# Altium project PolySomeCrypto01.PrjPcb (part 1 of 2)
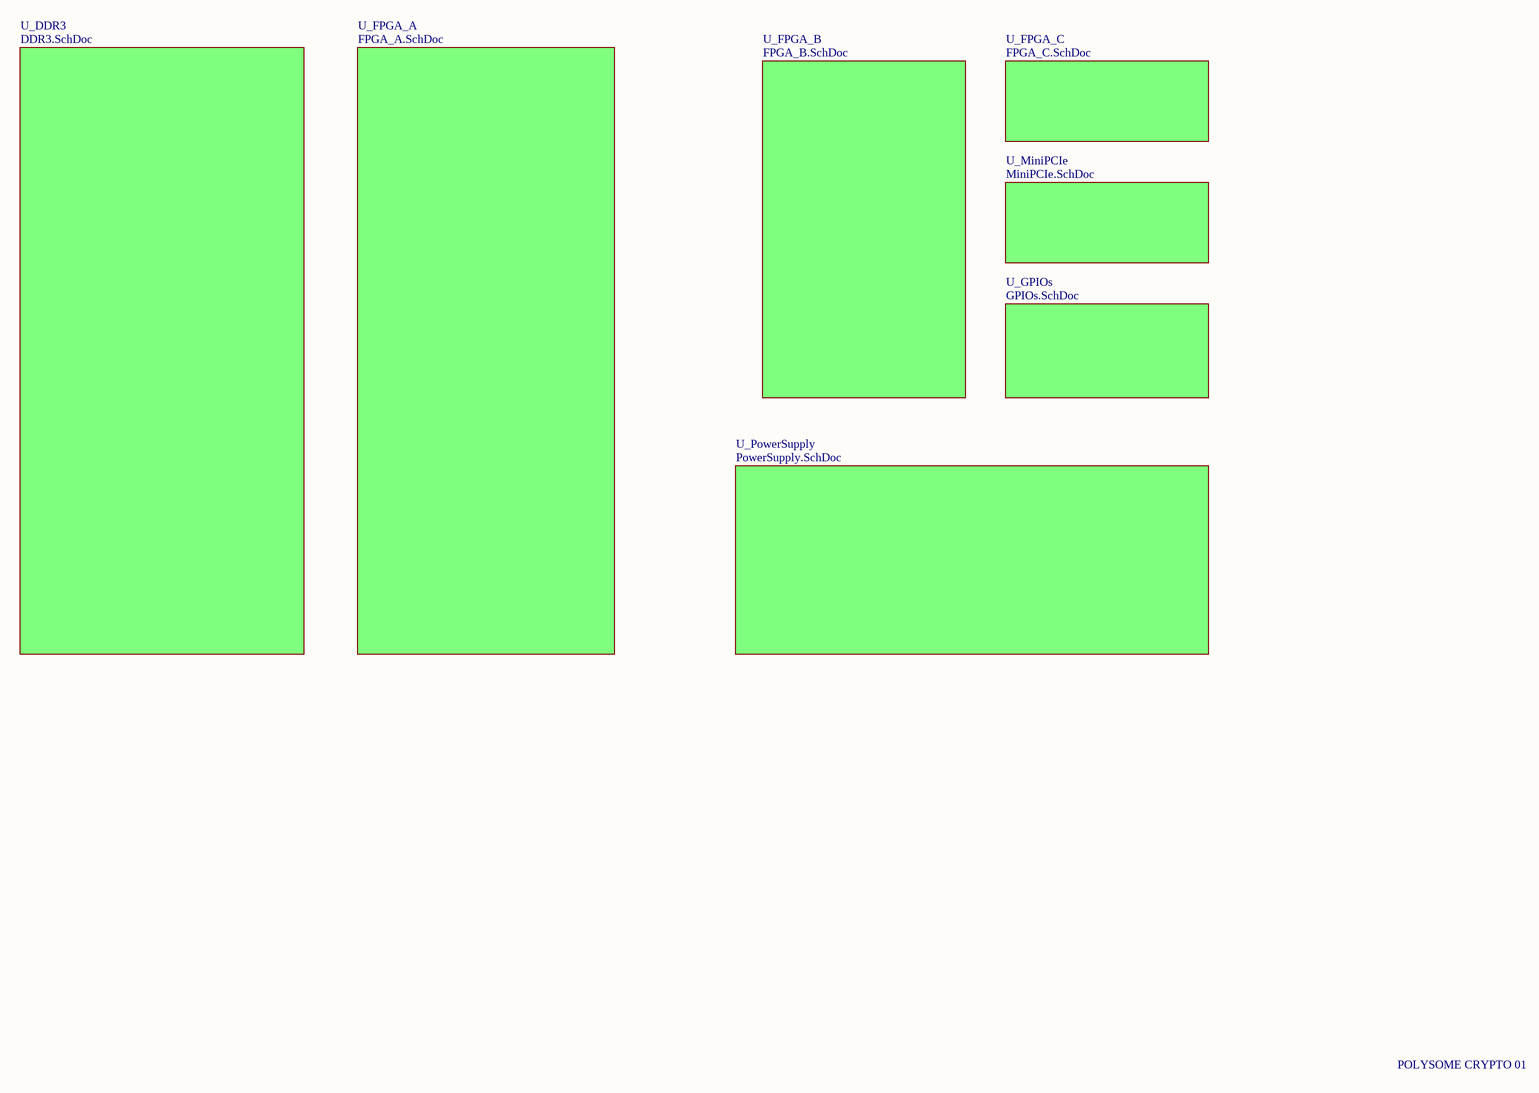
[diagram p0: PolySomeCrypto01.SchDoc]
8 sheets, 188 parts. Net scope: global (net labels, ports and power ports of the same name join across sheets).
Board file: PolysomeCrypto01.PcbDoc
Sheets:
  PolySomeCrypto01.SchDoc
    U_DDR3 = DDR3.SchDoc
    U_FPGA_A = FPGA_A.SchDoc
    U_FPGA_B = FPGA_B.SchDoc
    U_FPGA_C = FPGA_C.SchDoc
    U_MiniPCIe = MiniPCIe.SchDoc
    U_PowerSupply = PowerSupply.SchDoc
    U_GPIOs = GPIOs.SchDoc

## Sheet PolySomeCrypto01.SchDoc: PolySomeCrypto01
size A3; Revision: V1; SheetNumber: 1; SheetTotal: 8; DocumentName: PolysomeCrypto01; ProjectName: POLYSOME CRYPTO 01

### Sub-sheets
U_DDR3 = DDR3.SchDoc: no entries
U_FPGA_A = FPGA_A.SchDoc: no entries
U_FPGA_B = FPGA_B.SchDoc: no entries
U_FPGA_C = FPGA_C.SchDoc: no entries
U_GPIOs = GPIOs.SchDoc: no entries
U_MiniPCIe = MiniPCIe.SchDoc: no entries
U_PowerSupply = PowerSupply.SchDoc: no entries

### Notes on the sheet
- POLYSOME CRYPTO 01

## Sheet DDR3.SchDoc: POLYSOME CRYPTO 01
size A3; Revision: V1; SheetNumber: 5; SheetTotal: 8; ProjectName: POLYSOME CRYPTO 01
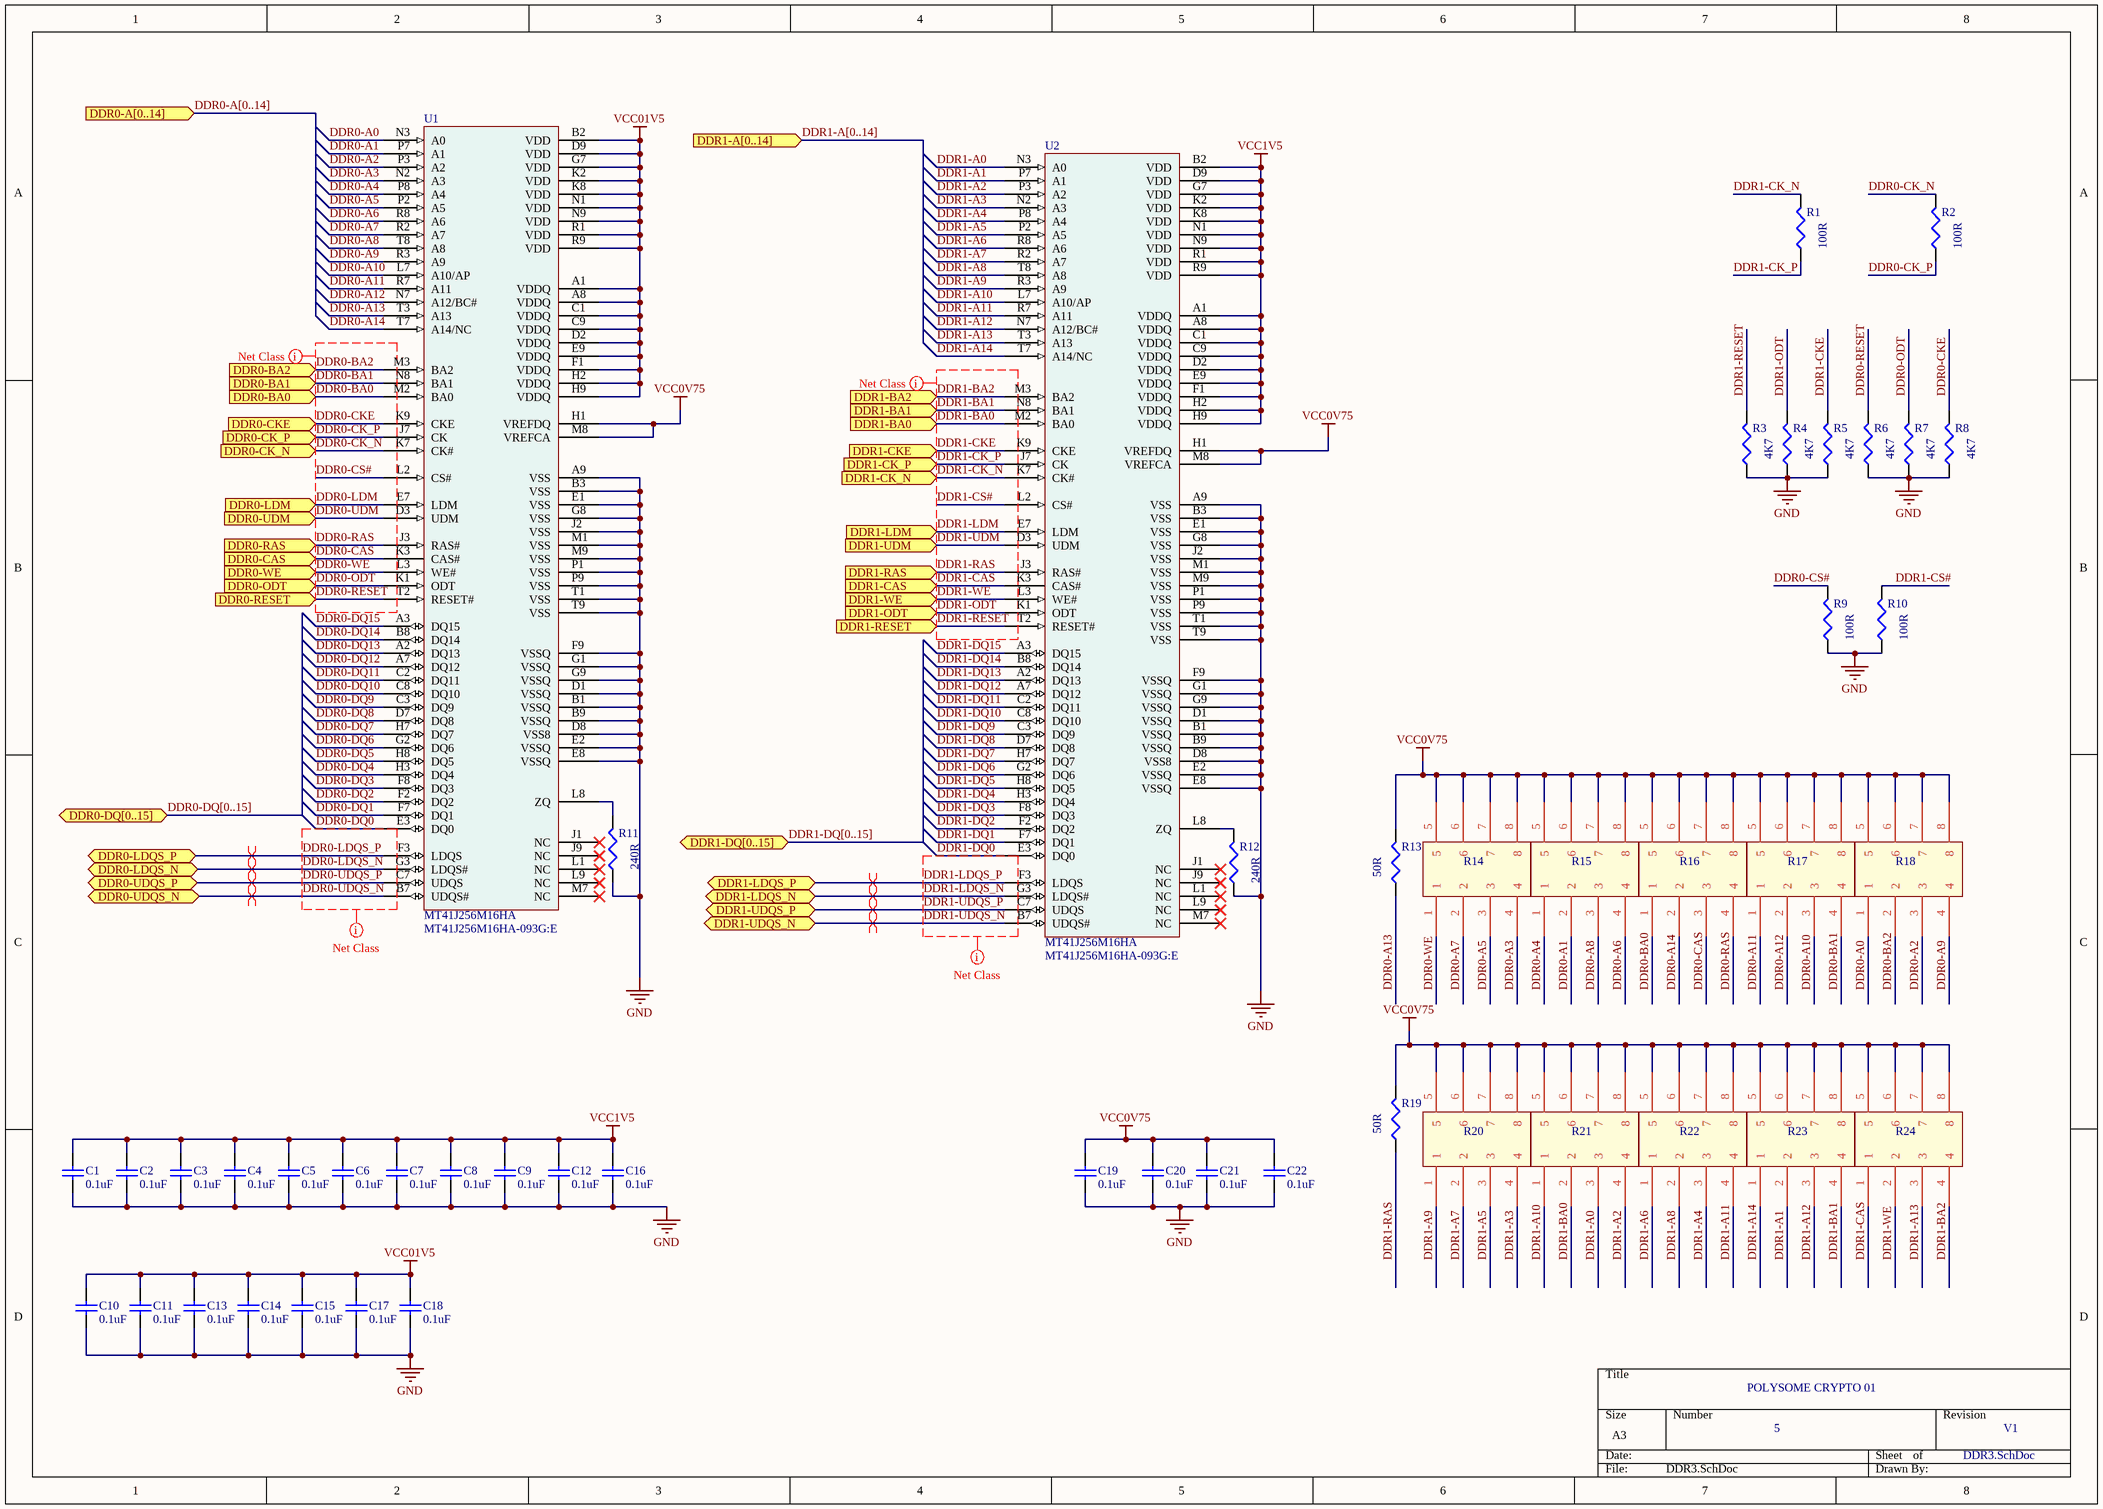
[diagram p1: DDR3.SchDoc]

### Parts
C1  value 0.1uF  [0402]  (hidden comment: Cap Semi)
C2  value 0.1uF  [0402]  (hidden comment: Cap Semi)
C3  value 0.1uF  [0402]  (hidden comment: Cap Semi)
C4  value 0.1uF  [0402]  (hidden comment: Cap Semi)
C5  value 0.1uF  [0402]  (hidden comment: Cap Semi)
C6  value 0.1uF  [0402]  (hidden comment: Cap Semi)
C7  value 0.1uF  [0402]  (hidden comment: Cap Semi)
C8  value 0.1uF  [0402]  (hidden comment: Cap Semi)
C9  value 0.1uF  [0402]  (hidden comment: Cap Semi)
C10  value 0.1uF  [0402]  (hidden comment: Cap Semi)
C11  value 0.1uF  [0402]  (hidden comment: Cap Semi)
C12  value 0.1uF  [0402]  (hidden comment: Cap Semi)
C13  value 0.1uF  [0402]  (hidden comment: Cap Semi)
C14  value 0.1uF  [0402]  (hidden comment: Cap Semi)
C15  value 0.1uF  [0402]  (hidden comment: Cap Semi)
C16  value 0.1uF  [0402]  (hidden comment: Cap Semi)
C17  value 0.1uF  [0402]  (hidden comment: Cap Semi)
C18  value 0.1uF  [0402]  (hidden comment: Cap Semi)
C19  value 0.1uF  [0402]  (hidden comment: Cap Semi)
C20  value 0.1uF  [0402]  (hidden comment: Cap Semi)
C21  value 0.1uF  [0402]  (hidden comment: Cap Semi)
C22  value 0.1uF  [0402]  (hidden comment: Cap Semi)
R1  value 100R  [0402]  (hidden comment: Res3)
R2  value 100R  [0402]  (hidden comment: Res3)
R3  value 4K7  [0402]  (hidden comment: Res3)
R4  value 4K7  [0402]  (hidden comment: Res3)
R5  value 4K7  [0402]  (hidden comment: Res3)
R6  value 4K7  [0402]  (hidden comment: Res3)
R7  value 4K7  [0402]  (hidden comment: Res3)
R8  value 4K7  [0402]  (hidden comment: Res3)
R9  value 100R  [0402]  (hidden comment: Res3)
R10  value 100R  [0402]  (hidden comment: Res3)
R11  value 240R  [0402]  (hidden comment: Res3)
R12  value 240R  [0402]  (hidden comment: Res3)
R13  value 50R  [0402]  (hidden comment: Res3)
R14  RES_4_PACK  [YC124-FR-0749R9L]  (value not drawn)
R15  RES_4_PACK  [YC124-FR-0749R9L]  (value not drawn)
R16  RES_4_PACK  [YC124-FR-0749R9L]  (value not drawn)
R17  RES_4_PACK  [YC124-FR-0749R9L]  (value not drawn)
R18  RES_4_PACK  [YC124-FR-0749R9L]  (value not drawn)
R19  value 50R  [0402]  (hidden comment: Res3)
R20  RES_4_PACK  [YC124-FR-0749R9L]  (value not drawn)
R21  RES_4_PACK  [YC124-FR-0749R9L]  (value not drawn)
R22  RES_4_PACK  [YC124-FR-0749R9L]  (value not drawn)
R23  RES_4_PACK  [YC124-FR-0749R9L]  (value not drawn)
R24  RES_4_PACK  [YC124-FR-0749R9L]  (value not drawn)
U1  MT41J256M16HA
U2  MT41J256M16HA

### Ports
DDR0-A[0..14] (in), DDR0-BA0 (in), DDR0-BA1 (in), DDR0-BA2 (in), DDR0-CAS (in), DDR0-CK_N (in), DDR0-CK_P (in), DDR0-CKE (in), DDR0-DQ[0..15] (bidir), DDR0-LDM (in), DDR0-LDQS_N (bidir), DDR0-LDQS_P (bidir), DDR0-ODT (in), DDR0-RAS (in), DDR0-RESET (in), DDR0-UDM (in), DDR0-UDQS_N (bidir), DDR0-UDQS_P (bidir), DDR0-WE (in), DDR1-A[0..14] (in), DDR1-BA0 (in), DDR1-BA1 (in), DDR1-BA2 (in), DDR1-CAS (in), DDR1-CK_N (in), DDR1-CK_P (in), DDR1-CKE (in), DDR1-DQ[0..15] (bidir), DDR1-LDM (in), DDR1-LDQS_N (bidir), DDR1-LDQS_P (bidir), DDR1-ODT (in), DDR1-RAS (in), DDR1-RESET (in), DDR1-UDM (in), DDR1-UDQS_N (bidir), DDR1-UDQS_P (bidir), DDR1-WE (in)

### Nets
GND: C1.1 C2.1 C3.1 C4.1 C5.1 C6.1 C7.1 C8.1 C9.1 C10.1 C11.1 C12.1 C13.1 C14.1 C15.1 C16.1 C17.1 C18.1 C19.2 C20.1 C21.1 C22.1 R3.1 R4.1 R5.1 R6.1 R7.1 R8.1 R9.1 R10.1 R11.1 R12.1 U1.A9(VSS) U1.B1(VSSQ) U1.B3(VSS) U1.B9(VSSQ) U1.D1(VSSQ) U1.D8(VSS8) U1.E1(VSS) U1.E2(VSSQ) U1.E8(VSSQ) U1.F9(VSSQ) U1.G1(VSSQ) U1.G8(VSS) U1.G9(VSSQ) U1.J2(VSS) U1.M1(VSS) U1.M9(VSS) U1.P1(VSS) U1.P9(VSS) U1.T1(VSS) U1.T9(VSS) U2.A9(VSS) U2.B1(VSSQ) U2.B3(VSS) U2.B9(VSSQ) U2.D1(VSSQ) U2.D8(VSS8) U2.E1(VSS) U2.E2(VSSQ) U2.E8(VSSQ) U2.F9(VSSQ) U2.G1(VSSQ) U2.G8(VSS) U2.G9(VSSQ) U2.J2(VSS) U2.M1(VSS) U2.M9(VSS) U2.P1(VSS) U2.P9(VSS) U2.T1(VSS) U2.T9(VSS)
VCC0V75: C19.1 C20.2 C21.2 C22.2 R13.2 R14.5 R14.6 R14.7 R14.8 R15.5 R15.6 R15.7 R15.8 R16.5 R16.6 R16.7 R16.8 R17.5 R17.6 R17.7 R17.8 R18.5 R18.6 R18.7 R18.8 R19.2 R20.5 R20.6 R20.7 R20.8 R21.5 R21.6 R21.7 R21.8 R22.5 R22.6 R22.7 R22.8 R23.5 R23.6 R23.7 R23.8 R24.5 R24.6 R24.7 R24.8 U1.H1(VREFDQ) U1.M8(VREFCA) U2.H1(VREFDQ) U2.M8(VREFCA)
VCC01V5: C10.2 C11.2 C13.2 C14.2 C15.2 C17.2 C18.2 U1.A1(VDDQ) U1.A8(VDDQ) U1.B2(VDD) U1.C1(VDDQ) U1.C9(VDDQ) U1.D2(VDDQ) U1.D9(VDD) U1.E9(VDDQ) U1.F1(VDDQ) U1.G7(VDD) U1.H2(VDDQ) U1.H9(VDDQ) U1.K2(VDD) U1.K8(VDD) U1.N1(VDD) U1.N9(VDD) U1.R1(VDD) U1.R9(VDD)
VCC1V5: C1.2 C2.2 C3.2 C4.2 C5.2 C6.2 C7.2 C8.2 C9.2 C12.2 C16.2 U2.A1(VDDQ) U2.A8(VDDQ) U2.B2(VDD) U2.C1(VDDQ) U2.C9(VDDQ) U2.D2(VDDQ) U2.D9(VDD) U2.E9(VDDQ) U2.F1(VDDQ) U2.G7(VDD) U2.H2(VDDQ) U2.H9(VDDQ) U2.K2(VDD) U2.K8(VDD) U2.N1(VDD) U2.N9(VDD) U2.R1(VDD) U2.R9(VDD)
DDR0-A0: R18.1 U1.N3(A0)
DDR0-A1: R15.2 U1.P7(A1)
DDR0-A2: R18.3 U1.P3(A2)
DDR0-A3: R14.4 U1.N2(A3)
DDR0-A4: R15.1 U1.P8(A4)
DDR0-A5: R14.3 U1.P2(A5)
DDR0-A6: R15.4 U1.R8(A6)
DDR0-A7: R14.2 U1.R2(A7)
DDR0-A8: R15.3 U1.T8(A8)
DDR0-A9: R18.4 U1.R3(A9)
DDR0-A10: R17.3 U1.L7(A10/AP)
DDR0-A11: R17.1 U1.R7(A11)
DDR0-A12: R17.2 U1.N7(A12/BC#)
DDR0-A13: R13.1 U1.T3(A13)
DDR0-A14: R16.2 U1.T7(A14/NC)
DDR0-BA0: R16.1 U1.M2(BA0) ; port DDR0-BA0
DDR0-BA1: R17.4 U1.N8(BA1) ; port DDR0-BA1
DDR0-BA2: R18.2 U1.M3(BA2) ; port DDR0-BA2
DDR0-CAS: R16.3 U1.K3(CAS#) ; port DDR0-CAS
DDR0-CK_N: R2.2 U1.K7(CK#) ; port DDR0-CK_N
DDR0-CK_P: R2.1 U1.J7(CK) ; port DDR0-CK_P
DDR0-CKE: R8.2 U1.K9(CKE) ; port DDR0-CKE
DDR0-CS#: R9.2 U1.L2(CS#)
DDR0-DQ0: U1.E3(DQ0)
DDR0-DQ1: U1.F7(DQ1)
DDR0-DQ2: U1.F2(DQ2)
DDR0-DQ3: U1.F8(DQ3)
DDR0-DQ4: U1.H3(DQ4)
DDR0-DQ5: U1.H8(DQ5)
DDR0-DQ6: U1.G2(DQ6)
DDR0-DQ7: U1.H7(DQ7)
DDR0-DQ8: U1.D7(DQ8)
DDR0-DQ9: U1.C3(DQ9)
DDR0-DQ10: U1.C8(DQ10)
DDR0-DQ11: U1.C2(DQ11)
DDR0-DQ12: U1.A7(DQ12)
DDR0-DQ13: U1.A2(DQ13)
DDR0-DQ14: U1.B8(DQ14)
DDR0-DQ15: U1.A3(DQ15)
DDR0-LDM: U1.E7(LDM) ; port DDR0-LDM
DDR0-LDQS_N: U1.G3(LDQS#) ; port DDR0-LDQS_N
DDR0-LDQS_P: U1.F3(LDQS) ; port DDR0-LDQS_P
DDR0-ODT: R7.2 U1.K1(ODT) ; port DDR0-ODT
DDR0-RAS: R16.4 U1.J3(RAS#) ; port DDR0-RAS
DDR0-RESET: R6.2 U1.T2(RESET#) ; port DDR0-RESET
DDR0-UDM: U1.D3(UDM) ; port DDR0-UDM
DDR0-UDQS_N: U1.B7(UDQS#) ; port DDR0-UDQS_N
DDR0-UDQS_P: U1.C7(UDQS) ; port DDR0-UDQS_P
DDR0-WE: R14.1 U1.L3(WE#) ; port DDR0-WE
DDR1-A0: R21.3 U2.N3(A0)
DDR1-A1: R23.2 U2.P7(A1)
DDR1-A2: R21.4 U2.P3(A2)
DDR1-A3: R20.4 U2.N2(A3)
DDR1-A4: R22.3 U2.P8(A4)
DDR1-A5: R20.3 U2.P2(A5)
DDR1-A6: R22.1 U2.R8(A6)
DDR1-A7: R20.2 U2.R2(A7)
DDR1-A8: R22.2 U2.T8(A8)
DDR1-A9: R20.1 U2.R3(A9)
DDR1-A10: R21.1 U2.L7(A10/AP)
DDR1-A11: R22.4 U2.R7(A11)
DDR1-A12: R23.3 U2.N7(A12/BC#)
DDR1-A13: R24.3 U2.T3(A13)
DDR1-A14: R23.1 U2.T7(A14/NC)
DDR1-BA0: R21.2 U2.M2(BA0) ; port DDR1-BA0
DDR1-BA1: R23.4 U2.N8(BA1) ; port DDR1-BA1
DDR1-BA2: R24.4 U2.M3(BA2) ; port DDR1-BA2
DDR1-CAS: R24.1 U2.K3(CAS#) ; port DDR1-CAS
DDR1-CK_N: R1.2 U2.K7(CK#) ; port DDR1-CK_N
DDR1-CK_P: R1.1 U2.J7(CK) ; port DDR1-CK_P
DDR1-CKE: R5.2 U2.K9(CKE) ; port DDR1-CKE
DDR1-CS#: R10.2 U2.L2(CS#)
DDR1-DQ0: U2.E3(DQ0)
DDR1-DQ1: U2.F7(DQ1)
DDR1-DQ2: U2.F2(DQ2)
DDR1-DQ3: U2.F8(DQ3)
DDR1-DQ4: U2.H3(DQ4)
DDR1-DQ5: U2.H8(DQ5)
DDR1-DQ6: U2.G2(DQ6)
DDR1-DQ7: U2.H7(DQ7)
DDR1-DQ8: U2.D7(DQ8)
DDR1-DQ9: U2.C3(DQ9)
DDR1-DQ10: U2.C8(DQ10)
DDR1-DQ11: U2.C2(DQ11)
DDR1-DQ12: U2.A7(DQ12)
DDR1-DQ13: U2.A2(DQ13)
DDR1-DQ14: U2.B8(DQ14)
DDR1-DQ15: U2.A3(DQ15)
DDR1-LDM: U2.E7(LDM) ; port DDR1-LDM
DDR1-LDQS_N: U2.G3(LDQS#) ; port DDR1-LDQS_N
DDR1-LDQS_P: U2.F3(LDQS) ; port DDR1-LDQS_P
DDR1-ODT: R4.2 U2.K1(ODT) ; port DDR1-ODT
DDR1-RAS: R19.1 U2.J3(RAS#) ; port DDR1-RAS
DDR1-RESET: R3.2 U2.T2(RESET#) ; port DDR1-RESET
DDR1-UDM: U2.D3(UDM) ; port DDR1-UDM
DDR1-UDQS_N: U2.B7(UDQS#) ; port DDR1-UDQS_N
DDR1-UDQS_P: U2.C7(UDQS) ; port DDR1-UDQS_P
DDR1-WE: R24.2 U2.L3(WE#) ; port DDR1-WE
NetR11_2: R11.2 U1.L8(ZQ)
NetR12_2: R12.2 U2.L8(ZQ)

Not connected (* = marked no-connect by the designer): U1 J1(NC)* J9(NC)* L1(NC)* L9(NC)* M7(NC)*; U2 J1(NC)* J9(NC)* L1(NC)* L9(NC)* M7(NC)*

### Buses and harness runs
bus DDR0-A[0..14] = port DDR0-A[0..14]
bus DDR0-DQ[0..15] = port DDR0-DQ[0..15]
bus DDR1-A[0..14] = port DDR1-A[0..14]
bus DDR1-DQ[0..15] = port DDR1-DQ[0..15]

### Layout directives
net class DDR0_CTRL: DDR0-BA0, DDR0-BA1, DDR0-BA2, DDR0-CAS, DDR0-CK_N, DDR0-CK_P, DDR0-CKE, DDR0-CS#, DDR0-DQ0, DDR0-LDM, DDR0-LDQS_N, DDR0-LDQS_P, DDR0-ODT, DDR0-RAS, DDR0-RESET, DDR0-UDM, DDR0-UDQS_N, DDR0-UDQS_P, DDR0-WE
net class DDR1_CTRL: DDR1-BA0, DDR1-BA1, DDR1-BA2, DDR1-CAS, DDR1-CK_N, DDR1-CK_P, DDR1-CKE, DDR1-CS#, DDR1-DQ0, DDR1-LDM, DDR1-LDQS_N, DDR1-LDQS_P, DDR1-ODT, DDR1-RAS, DDR1-RESET, DDR1-UDM, DDR1-UDQS_N, DDR1-UDQS_P, DDR1-WE
differential pair; net class DDR0_LDQS: DDR0-LDQS_N, DDR0-LDQS_P
differential pair; net class DDR0_UDQS: DDR0-UDQS_N, DDR0-UDQS_P
differential pair; net class DDR1_LDQS: DDR1-LDQS_N, DDR1-LDQS_P
differential pair; net class DDR1_UDQS: DDR1-UDQS_N, DDR1-UDQS_P

### Notes on the sheet
- POLYSOME CRYPTO 01

### Library data of the parts
C1-C22 = Cap Semi: Capacitor (Semiconductor SIM Model); Published: 8-Jun-2000; LatestRevisionDate: 29-May-2009; LatestRevisionNote: IPC-7351 Footprint Added.; PackageReference: C1206; Publisher: Altium Limited; PackageDescription: Chip Capacitor
R1-R13 R19 = Res3: Resistor; Published: 8-Jun-2000; LatestRevisionDate: 29-May-2009; LatestRevisionNote: IPC-7351 Footprint Added.; PackageReference: J1-0603; Publisher: Altium Limited; PackageDescription: Chip Resistor
R14-R18 R20-R24 = YC124-FR-0749R9L: Resistor Networks & Arrays 49.9 Ohm 1% 1/16W 50 Volts; Manufacturer: Yageo; Temperature Coefficient: 200 PPM / C; Voltage Rating: 25 V; Number of Resistors: 4; Case Height: 0.45 mm; Case Length: 2 mm; Case Width: 1 mm; Power per Element: 0.063 W (1/16 W); Resistor Values: 49.9 Ohms; Product Status: New at Mouser; Supplier 1: Mouser; Manufacturer Part Number: YC124-FR-0749R9L; RoHS: RoHS Compliant By Exemption; Category: Resistor Networks & Arrays; Stock 1: 0; Pricing 1: 10000=0.053, 20000=0.051, 50000=0.049, 100000=0.047 (AUD); Operating Temperature Range: - 55 C to + 155 C; Packaging: Reel; Product: Array Chip Resistors; Series: YC/TC164; Termination Style: SMD/SMT; Tolerance: 1 %; Brand: Yageo; Number of Pins: 8; Product Category: Resistor Arrays; Product Type: Arrays; RoHS - Mouser: Y; Minimum Order Quantity: 10000; Reeling: True; ComponentLink1URL: http://www.mouser.com/ds/2/447/PYu-YC_TC124_51_RoHS_L_2-519518.pdf; ComponentLink1Description: http://www.mouser.com/ds/2/447/PYu-YC_TC124_51_RoHS_L_2-519518.pdf; Supplier Part Number 1: 603-YC124-FR-0749R9L
U1 U2 = MT41J256M16HA-093G:E: IC DDR3 SDRAM 4GBIT FBGA; Manufacturer: Micron Technology Inc; Format - Memory: RAM; Memory Size: 4G (256M x 16); Speed: 1066MHz; Interface: Parallel; Voltage - Supply: 1.425 V ~ 1.575 V; Supplier 1: Digi-Key; RoHS: RoHS Compliant; Category: Integrated Circuits (ICs); Stock 1: 0; Pricing 1: 1000=9.33075 (USD); Packaging: Tray; Memory Type: DDR3 SDRAM; Operating Temperature: 0°C ~ 95°C; Package / Case: 96-TFBGA; Supplier Device Package: 96-FBGA (9x14); ComponentLink1URL: http://www.micron.com/~/media/Documents/Products/Data%20Sheet/DRAM/DDR3/4Gb_DDR3_SDRAM.pdf; ComponentLink1Description: http://www.micron.com/~/media/Documents/Products/Data%20Sheet/DRAM/DDR3/4Gb_DDR3_SDRAM.pdf; Supplier Part Number 1: MT41J256M16HA-093G:E-ND; Manufacturer Part Number: MT41J256M16HA-093G:E

## Sheet FPGA_A.SchDoc: POLYSOME CRYPTO 01
size Tabloid; Revision: V1; SheetNumber: 2; SheetTotal: 8; ProjectName: POLYSOME CRYPTO 01
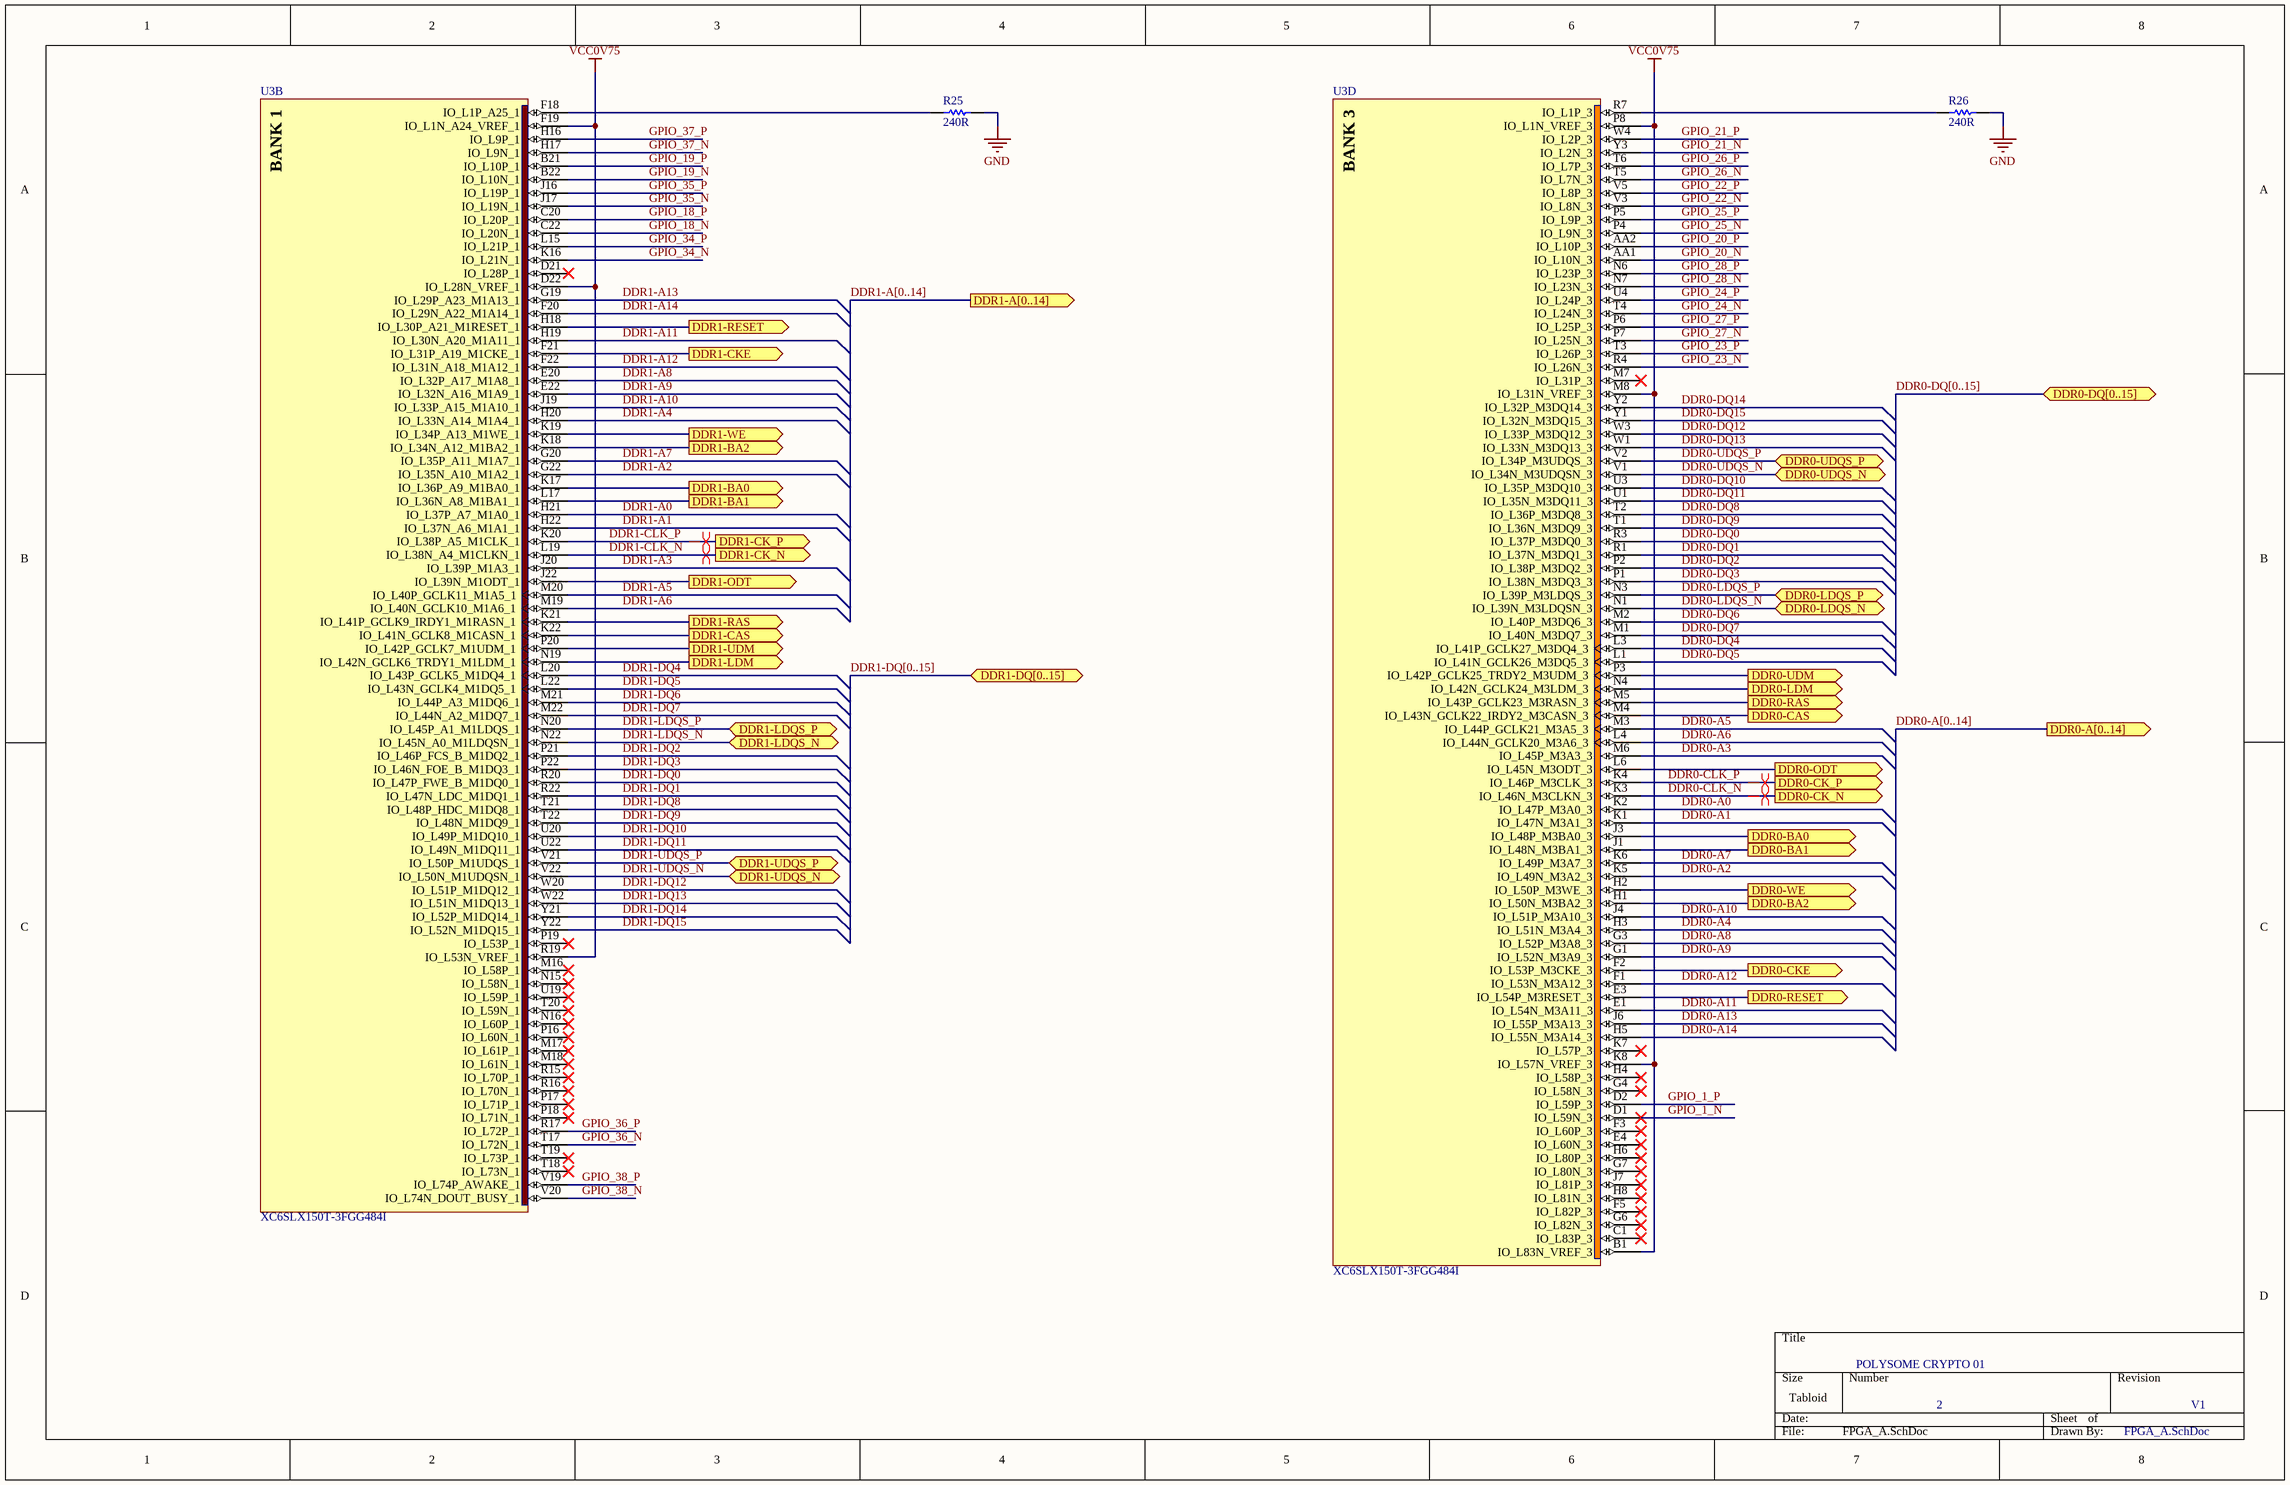
[diagram p2: FPGA_A.SchDoc]

### Parts
R25  value 240R  [0402]  (hidden comment: Res Semi)
R26  value 240R  [0402]  (hidden comment: Res Semi)
U3  XC6SLX150T-3FGG484I  [FGG484]  (parts B,D of 8)

### Ports
DDR0-A[0..14] (out), DDR0-BA0 (out), DDR0-BA1 (out), DDR0-BA2 (out), DDR0-CAS (out), DDR0-CK_N (out), DDR0-CK_P (out), DDR0-CKE (out), DDR0-DQ[0..15] (bidir), DDR0-LDM (out), DDR0-LDQS_N (bidir), DDR0-LDQS_P (bidir), DDR0-ODT (out), DDR0-RAS (out), DDR0-RESET (out), DDR0-UDM (out), DDR0-UDQS_N (bidir), DDR0-UDQS_P (bidir), DDR0-WE (out), DDR1-A[0..14] (out), DDR1-BA0 (out), DDR1-BA1 (out), DDR1-BA2 (out), DDR1-CAS (out), DDR1-CK_N (out), DDR1-CK_P (out), DDR1-CKE (out), DDR1-DQ[0..15] (bidir), DDR1-LDM (out), DDR1-LDQS_N (bidir), DDR1-LDQS_P (bidir), DDR1-ODT (out), DDR1-RAS (out), DDR1-RESET (out), DDR1-UDM (out), DDR1-UDQS_N (bidir), DDR1-UDQS_P (bidir), DDR1-WE (out)

### Nets
GND: R25.2 R26.2
VCC0V75: U3.B1(IO_L83N_VREF_3) U3.D22(IO_L28N_VREF_1) U3.F19(IO_L1N_A24_VREF_1) U3.K8(IO_L57N_VREF_3) U3.M8(IO_L31N_VREF_3) U3.P8(IO_L1N_VREF_3) U3.R19(IO_L53N_VREF_1)
DDR0-A0: U3.K2(IO_L47P_M3A0_3)
DDR0-A1: U3.K1(IO_L47N_M3A1_3)
DDR0-A2: U3.K5(IO_L49N_M3A2_3)
DDR0-A3: U3.M6(IO_L45P_M3A3_3)
DDR0-A4: U3.H3(IO_L51N_M3A4_3)
DDR0-A5: U3.M3(IO_L44P_GCLK21_M3A5_3)
DDR0-A6: U3.L4(IO_L44N_GCLK20_M3A6_3)
DDR0-A7: U3.K6(IO_L49P_M3A7_3)
DDR0-A8: U3.G3(IO_L52P_M3A8_3)
DDR0-A9: U3.G1(IO_L52N_M3A9_3)
DDR0-A10: U3.J4(IO_L51P_M3A10_3)
DDR0-A11: U3.E1(IO_L54N_M3A11_3)
DDR0-A12: U3.F1(IO_L53N_M3A12_3)
DDR0-A13: U3.J6(IO_L55P_M3A13_3)
DDR0-A14: U3.H5(IO_L55N_M3A14_3)
DDR0-BA0: U3.J3(IO_L48P_M3BA0_3) ; port DDR0-BA0
DDR0-BA1: U3.J1(IO_L48N_M3BA1_3) ; port DDR0-BA1
DDR0-BA2: U3.H1(IO_L50N_M3BA2_3) ; port DDR0-BA2
DDR0-CAS: U3.M4(IO_L43N_GCLK22_IRDY2_M3CASN_3) ; port DDR0-CAS
DDR0-CKE: U3.F2(IO_L53P_M3CKE_3) ; port DDR0-CKE
DDR0-CLK_N: U3.K3(IO_L46N_M3CLKN_3) ; port DDR0-CK_N  [project net DDR0-CK_N]
DDR0-CLK_P: U3.K4(IO_L46P_M3CLK_3) ; port DDR0-CK_P  [project net DDR0-CK_P]
DDR0-DQ0: U3.R3(IO_L37P_M3DQ0_3)
DDR0-DQ1: U3.R1(IO_L37N_M3DQ1_3)
DDR0-DQ2: U3.P2(IO_L38P_M3DQ2_3)
DDR0-DQ3: U3.P1(IO_L38N_M3DQ3_3)
DDR0-DQ4: U3.L3(IO_L41P_GCLK27_M3DQ4_3)
DDR0-DQ5: U3.L1(IO_L41N_GCLK26_M3DQ5_3)
DDR0-DQ6: U3.M2(IO_L40P_M3DQ6_3)
DDR0-DQ7: U3.M1(IO_L40N_M3DQ7_3)
DDR0-DQ8: U3.T2(IO_L36P_M3DQ8_3)
DDR0-DQ9: U3.T1(IO_L36N_M3DQ9_3)
DDR0-DQ10: U3.U3(IO_L35P_M3DQ10_3)
DDR0-DQ11: U3.U1(IO_L35N_M3DQ11_3)
DDR0-DQ12: U3.W3(IO_L33P_M3DQ12_3)
DDR0-DQ13: U3.W1(IO_L33N_M3DQ13_3)
DDR0-DQ14: U3.Y2(IO_L32P_M3DQ14_3)
DDR0-DQ15: U3.Y1(IO_L32N_M3DQ15_3)
DDR0-LDM: U3.N4(IO_L42N_GCLK24_M3LDM_3) ; port DDR0-LDM
DDR0-LDQS_N: U3.N1(IO_L39N_M3LDQSN_3) ; port DDR0-LDQS_N
DDR0-LDQS_P: U3.N3(IO_L39P_M3LDQS_3) ; port DDR0-LDQS_P
DDR0-ODT: U3.L6(IO_L45N_M3ODT_3) ; port DDR0-ODT
DDR0-RAS: U3.M5(IO_L43P_GCLK23_M3RASN_3) ; port DDR0-RAS
DDR0-RESET: U3.E3(IO_L54P_M3RESET_3) ; port DDR0-RESET
DDR0-UDM: U3.P3(IO_L42P_GCLK25_TRDY2_M3UDM_3) ; port DDR0-UDM
DDR0-UDQS_N: U3.V1(IO_L34N_M3UDQSN_3) ; port DDR0-UDQS_N
DDR0-UDQS_P: U3.V2(IO_L34P_M3UDQS_3) ; port DDR0-UDQS_P
DDR0-WE: U3.H2(IO_L50P_M3WE_3) ; port DDR0-WE
DDR1-A0: U3.H21(IO_L37P_A7_M1A0_1)
DDR1-A1: U3.H22(IO_L37N_A6_M1A1_1)
DDR1-A2: U3.G22(IO_L35N_A10_M1A2_1)
DDR1-A3: U3.J20(IO_L39P_M1A3_1)
DDR1-A4: U3.H20(IO_L33N_A14_M1A4_1)
DDR1-A5: U3.M20(IO_L40P_GCLK11_M1A5_1)
DDR1-A6: U3.M19(IO_L40N_GCLK10_M1A6_1)
DDR1-A7: U3.G20(IO_L35P_A11_M1A7_1)
DDR1-A8: U3.E20(IO_L32P_A17_M1A8_1)
DDR1-A9: U3.E22(IO_L32N_A16_M1A9_1)
DDR1-A10: U3.J19(IO_L33P_A15_M1A10_1)
DDR1-A11: U3.H19(IO_L30N_A20_M1A11_1)
DDR1-A12: U3.F22(IO_L31N_A18_M1A12_1)
DDR1-A13: U3.G19(IO_L29P_A23_M1A13_1)
DDR1-A14: U3.F20(IO_L29N_A22_M1A14_1)
DDR1-BA0: U3.K17(IO_L36P_A9_M1BA0_1) ; port DDR1-BA0
DDR1-BA1: U3.L17(IO_L36N_A8_M1BA1_1) ; port DDR1-BA1
DDR1-BA2: U3.K18(IO_L34N_A12_M1BA2_1) ; port DDR1-BA2
DDR1-CAS: U3.K22(IO_L41N_GCLK8_M1CASN_1) ; port DDR1-CAS
DDR1-CKE: U3.F21(IO_L31P_A19_M1CKE_1) ; port DDR1-CKE
DDR1-CLK_N: U3.L19(IO_L38N_A4_M1CLKN_1) ; port DDR1-CK_N  [project net DDR1-CK_N]
DDR1-CLK_P: U3.K20(IO_L38P_A5_M1CLK_1) ; port DDR1-CK_P  [project net DDR1-CK_P]
DDR1-DQ0: U3.R20(IO_L47P_FWE_B_M1DQ0_1)
DDR1-DQ1: U3.R22(IO_L47N_LDC_M1DQ1_1)
DDR1-DQ2: U3.P21(IO_L46P_FCS_B_M1DQ2_1)
DDR1-DQ3: U3.P22(IO_L46N_FOE_B_M1DQ3_1)
DDR1-DQ4: U3.L20(IO_L43P_GCLK5_M1DQ4_1)
DDR1-DQ5: U3.L22(IO_L43N_GCLK4_M1DQ5_1)
DDR1-DQ6: U3.M21(IO_L44P_A3_M1DQ6_1)
DDR1-DQ7: U3.M22(IO_L44N_A2_M1DQ7_1)
DDR1-DQ8: U3.T21(IO_L48P_HDC_M1DQ8_1)
DDR1-DQ9: U3.T22(IO_L48N_M1DQ9_1)
DDR1-DQ10: U3.U20(IO_L49P_M1DQ10_1)
DDR1-DQ11: U3.U22(IO_L49N_M1DQ11_1)
DDR1-DQ12: U3.W20(IO_L51P_M1DQ12_1)
DDR1-DQ13: U3.W22(IO_L51N_M1DQ13_1)
DDR1-DQ14: U3.Y21(IO_L52P_M1DQ14_1)
DDR1-DQ15: U3.Y22(IO_L52N_M1DQ15_1)
DDR1-LDM: U3.N19(IO_L42N_GCLK6_TRDY1_M1LDM_1) ; port DDR1-LDM
DDR1-LDQS_N: U3.N22(IO_L45N_A0_M1LDQSN_1) ; port DDR1-LDQS_N
DDR1-LDQS_P: U3.N20(IO_L45P_A1_M1LDQS_1) ; port DDR1-LDQS_P
DDR1-ODT: U3.J22(IO_L39N_M1ODT_1) ; port DDR1-ODT
DDR1-RAS: U3.K21(IO_L41P_GCLK9_IRDY1_M1RASN_1) ; port DDR1-RAS
DDR1-RESET: U3.H18(IO_L30P_A21_M1RESET_1) ; port DDR1-RESET
DDR1-UDM: U3.P20(IO_L42P_GCLK7_M1UDM_1) ; port DDR1-UDM
DDR1-UDQS_N: U3.V22(IO_L50N_M1UDQSN_1) ; port DDR1-UDQS_N
DDR1-UDQS_P: U3.V21(IO_L50P_M1UDQS_1) ; port DDR1-UDQS_P
DDR1-WE: U3.K19(IO_L34P_A13_M1WE_1) ; port DDR1-WE
GPIO_1_N: U3.D1(IO_L59N_3)
GPIO_1_P: U3.D2(IO_L59P_3)
GPIO_18_N: U3.C22(IO_L20N_1)
GPIO_18_P: U3.C20(IO_L20P_1)
GPIO_19_N: U3.B22(IO_L10N_1)
GPIO_19_P: U3.B21(IO_L10P_1)
GPIO_20_N: U3.AA1(IO_L10N_3)
GPIO_20_P: U3.AA2(IO_L10P_3)
GPIO_21_N: U3.Y3(IO_L2N_3)
GPIO_21_P: U3.W4(IO_L2P_3)
GPIO_22_N: U3.V3(IO_L8N_3)
GPIO_22_P: U3.V5(IO_L8P_3)
GPIO_23_N: U3.R4(IO_L26N_3)
GPIO_23_P: U3.T3(IO_L26P_3)
GPIO_24_N: U3.T4(IO_L24N_3)
GPIO_24_P: U3.U4(IO_L24P_3)
GPIO_25_N: U3.P4(IO_L9N_3)
GPIO_25_P: U3.P5(IO_L9P_3)
GPIO_26_N: U3.T5(IO_L7N_3)
GPIO_26_P: U3.T6(IO_L7P_3)
GPIO_27_N: U3.P7(IO_L25N_3)
GPIO_27_P: U3.P6(IO_L25P_3)
GPIO_28_N: U3.N7(IO_L23N_3)
GPIO_28_P: U3.N6(IO_L23P_3)
GPIO_34_N: U3.K16(IO_L21N_1)
GPIO_34_P: U3.L15(IO_L21P_1)
GPIO_35_N: U3.J17(IO_L19N_1)
GPIO_35_P: U3.J16(IO_L19P_1)
GPIO_36_N: U3.T17(IO_L72N_1)
GPIO_36_P: U3.R17(IO_L72P_1)
GPIO_37_N: U3.H17(IO_L9N_1)
GPIO_37_P: U3.H16(IO_L9P_1)
GPIO_38_N: U3.V20(IO_L74N_DOUT_BUSY_1)
GPIO_38_P: U3.V19(IO_L74P_AWAKE_1)
NetR25_1: R25.1 U3.F18(IO_L1P_A25_1)
NetR26_1: R26.1 U3.R7(IO_L1P_3)

Not connected (* = marked no-connect by the designer): U3 C1(IO_L83P_3)* D21(IO_L28P_1)* E4(IO_L60N_3)* F3(IO_L60P_3)* F5(IO_L82P_3)* G4(IO_L58N_3)* G6(IO_L82N_3)* G7(IO_L80N_3)* H4(IO_L58P_3)* H6(IO_L80P_3)* H8(IO_L81N_3)* J7(IO_L81P_3)* K7(IO_L57P_3)* M7(IO_L31P_3)* M16(IO_L58P_1)* M17(IO_L61P_1)* M18(IO_L61N_1)* N15(IO_L58N_1)* N16(IO_L60P_1)* P16(IO_L60N_1)* P17(IO_L71P_1)* P18(IO_L71N_1)* P19(IO_L53P_1)* R15(IO_L70P_1)* R16(IO_L70N_1)* T18(IO_L73N_1)* T19(IO_L73P_1)* T20(IO_L59N_1)* U19(IO_L59P_1)*

### Buses and harness runs
bus DDR0-A[0..14] = port DDR0-A[0..14]
bus DDR0-DQ[0..15] = port DDR0-DQ[0..15]
bus DDR1-A[0..14] = port DDR1-A[0..14]
bus DDR1-DQ[0..15] = port DDR1-DQ[0..15]

### Layout directives
differential pair; net class DDR1_CLK: DDR1-CK_N, DDR1-CK_P
differential pair; net class DDR0_CLK: DDR0-CK_N, DDR0-CK_P

### Notes on the sheet
- POLYSOME CRYPTO 01
- (in symbol XC6SLX150T-3FGG484I, part B) BANK 1
- (in symbol XC6SLX150T-3FGG484I, part D) BANK 3

### Library data of the parts
R25 R26 = Res Semi: Semiconductor Resistor; Published: 8-Jun-2000; LatestRevisionDate: 17-Jul-2002; LatestRevisionNote: Re-released for DXP Platform.; PackageReference: AXIAL-0.5; Publisher: Altium Limited; PackageDescription: Axial Device, Thru-Hole; 2 Leads; 0.5 in Pin Spacing
U3 = XC6SLX150T-3FGG484I: Spartan-6 LXT 1.2V FPGA, 296 User I/Os, 484-Ball Fine-Pitch BGA (1.0mm Pitch), Speed Grade 3, Industrial Grade, Pb-Free; Published: 17-Nov-2009; DatasheetVersion: ver1.6, Nov-2010; PackageVersion: ver1.1, Dec-2008; PackageReference: FGG484; Publisher: Altium Limited; PackageDescription: 484-Ball Fine Pitch Ball Grid Array 1.00 mm Pitch (FGG484) - Pb-Free; Supplier 1: Digi-Key; Supplier Part Number 1: XC6SLX150T-3FGG484I-ND; Code_JEDEC: MS-034-AAJ-1; Code_IPC: BGA100P22X22-484; ComponentLink1Description: Manufacturer Link; ComponentLink1URL: http://www.xilinx.com; ComponentLink2Description: Spartan-6 Datasheet; ComponentLink2URL: http://www.xilinx.com/support/documentation/data_sheets/ds160.pdf; ComponentLink3Description: Spartan-6 Documents; ComponentLink3URL: http://www.xilinx.com/support/documentation/spartan-6.htm; ComponentLink4Description: Xilinx.com Home; ComponentLink4URL: http://www.xilinx.com

## Sheet FPGA_B.SchDoc: POLYSOME CRYPTO 01
size A3; Revision: V1; SheetNumber: 3; SheetTotal: 8; ProjectName: POLYSOME CRYPTO 01
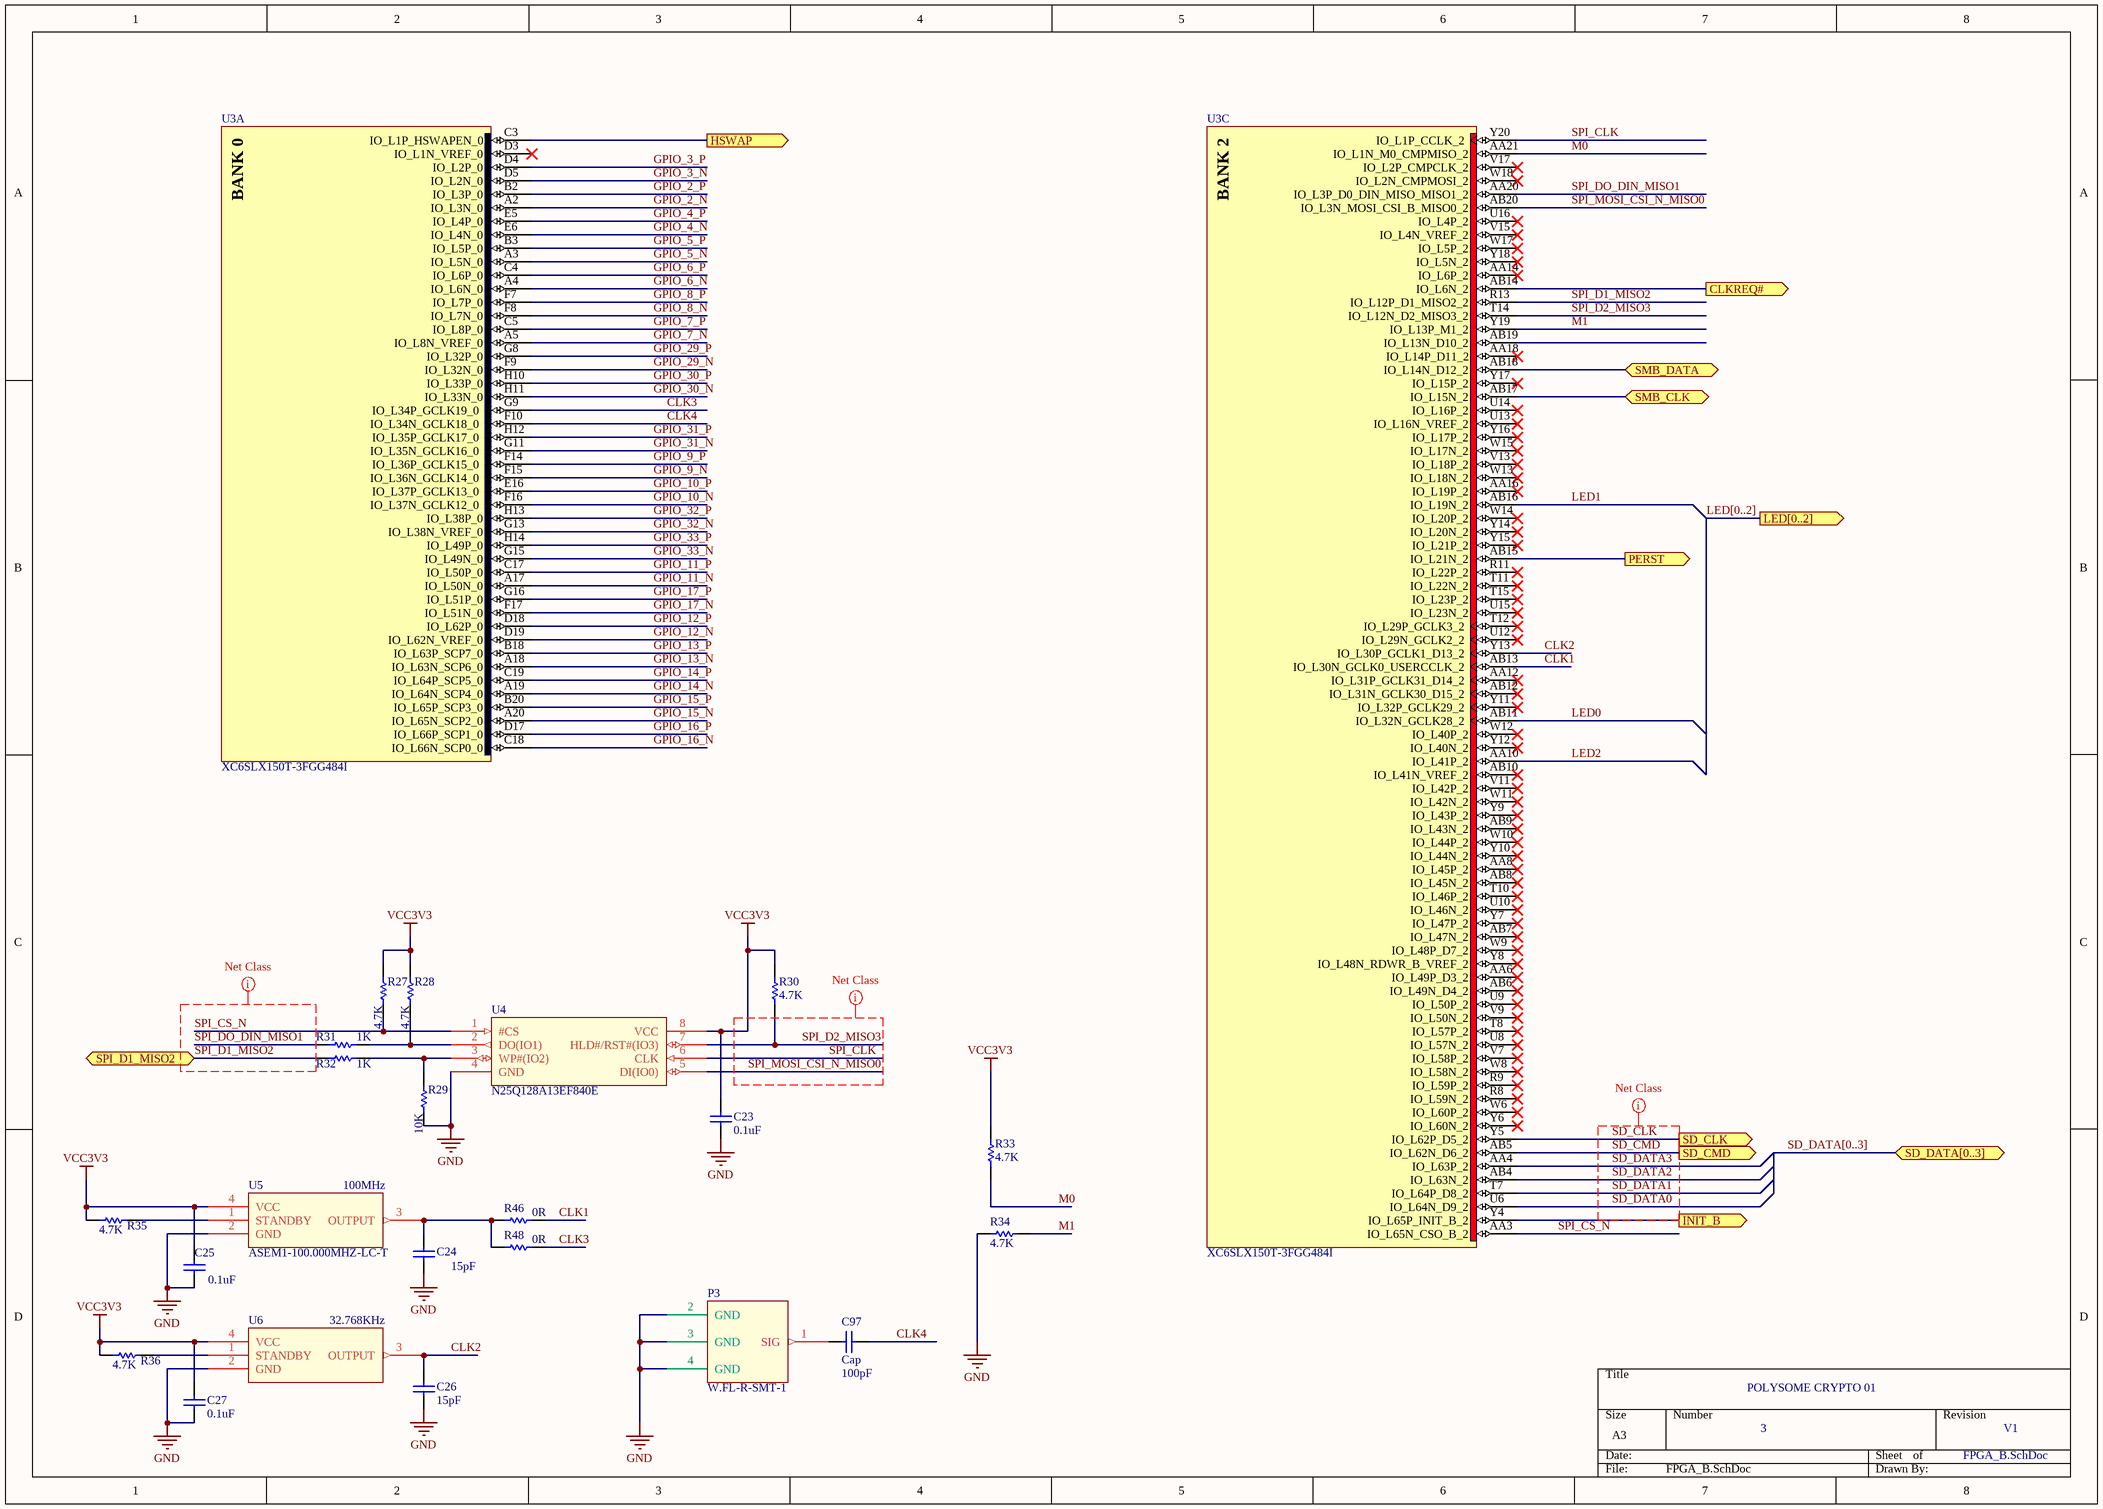
[diagram p3: FPGA_B.SchDoc]

### Parts
C23  value 0.1uF  [0402]  (hidden comment: Cap Semi)
C24  value 15pF  [0402]  (hidden comment: Cap Semi)
C25  value 0.1uF  [0402]  (hidden comment: Cap Semi)
C26  value 15pF  [0402]  (hidden comment: Cap Semi)
C27  value 0.1uF  [0402]  (hidden comment: Cap Semi)
C97  Cap  value 100pF  [0402]
P3  W.FL-R-SMT-1  [W.FL-R-SMT-1]
R27  value 4.7K  [0402]  (hidden comment: Res Semi)
R28  value 4.7K  [0402]  (hidden comment: Res Semi)
R29  value 10K  [0402]  (hidden comment: Res Semi)
R30  value 4.7K  [0402]  (hidden comment: Res Semi)
R31  value 1K  [0402]  (hidden comment: Res Semi)
R32  value 1K  [0402]  (hidden comment: Res Semi)
R33  value 4.7K  [0402]  (hidden comment: Res Semi)
R34  value 4.7K  [0402]  (hidden comment: Res Semi)
R35  value 4.7K  [0402]  (hidden comment: Res Semi)
R36  value 4.7K  [0402]  (hidden comment: Res Semi)
R46  value 0R  [0402]  (hidden comment: Res Semi)
R48  value 0R  [0402]  (hidden comment: Res Semi)
U3  XC6SLX150T-3FGG484I  [FGG484]  (parts A,C of 8)
U4  N25Q128A13EF840E  [8S2_L]
U5  ASEM1-100.000MHZ-LC-T  [DFN170P200X100-4N]
U6  ASEM1-LC-T  (value not drawn)

### Ports
CLKREQ# (out), HSWAP (out), INIT_B (out), LED[0..2] (out), PERST (out), SD_CLK (out), SD_CMD (out), SD_DATA[0..3] (bidir), SMB_CLK (bidir), SMB_DATA (bidir), SPI_D1_MISO2

### Nets
GND: C23.1 C24.1 C25.2 C26.2 C27.2 P3.2(GND) P3.3(GND) P3.4(GND) R29.1 R34.2 U4.4(GND) U5.2(GND) U6.2(GND)
VCC3V3: C23.2 C25.1 C27.1 R27.2 R28.2 R30.2 R33.2 R35.1 R36.1 U4.8(VCC) U5.4(VCC) U6.4(VCC)
CLK1: R46.2 U3.AB13(IO_L30N_GCLK0_USERCCLK_2)
CLK2: C26.1 U3.Y13(IO_L30P_GCLK1_D13_2) U6.3(OUTPUT)
CLK3: R48.2 U3.G9(IO_L34P_GCLK19_0)
CLK4: C97.2 U3.F10(IO_L34N_GCLK18_0)
CLKREQ#: U3.AB14(IO_L6N_2) ; port CLKREQ#
GPIO_2_N: U3.A2(IO_L3N_0)
GPIO_2_P: U3.B2(IO_L3P_0)
GPIO_3_N: U3.D5(IO_L2N_0)
GPIO_3_P: U3.D4(IO_L2P_0)
GPIO_4_N: U3.E6(IO_L4N_0)
GPIO_4_P: U3.E5(IO_L4P_0)
GPIO_5_N: U3.A3(IO_L5N_0)
GPIO_5_P: U3.B3(IO_L5P_0)
GPIO_6_N: U3.A4(IO_L6N_0)
GPIO_6_P: U3.C4(IO_L6P_0)
GPIO_7_N: U3.A5(IO_L8N_VREF_0)
GPIO_7_P: U3.C5(IO_L8P_0)
GPIO_8_N: U3.F8(IO_L7N_0)
GPIO_8_P: U3.F7(IO_L7P_0)
GPIO_9_N: U3.F15(IO_L36N_GCLK14_0)
GPIO_9_P: U3.F14(IO_L36P_GCLK15_0)
GPIO_10_N: U3.F16(IO_L37N_GCLK12_0)
GPIO_10_P: U3.E16(IO_L37P_GCLK13_0)
GPIO_11_N: U3.A17(IO_L50N_0)
GPIO_11_P: U3.C17(IO_L50P_0)
GPIO_12_N: U3.D19(IO_L62N_VREF_0)
GPIO_12_P: U3.D18(IO_L62P_0)
GPIO_13_N: U3.A18(IO_L63N_SCP6_0)
GPIO_13_P: U3.B18(IO_L63P_SCP7_0)
GPIO_14_N: U3.A19(IO_L64N_SCP4_0)
GPIO_14_P: U3.C19(IO_L64P_SCP5_0)
GPIO_15_N: U3.A20(IO_L65N_SCP2_0)
GPIO_15_P: U3.B20(IO_L65P_SCP3_0)
GPIO_16_N: U3.C18(IO_L66N_SCP0_0)
GPIO_16_P: U3.D17(IO_L66P_SCP1_0)
GPIO_17_N: U3.F17(IO_L51N_0)
GPIO_17_P: U3.G16(IO_L51P_0)
GPIO_29_N: U3.F9(IO_L32N_0)
GPIO_29_P: U3.G8(IO_L32P_0)
GPIO_30_N: U3.H11(IO_L33N_0)
GPIO_30_P: U3.H10(IO_L33P_0)
GPIO_31_N: U3.G11(IO_L35N_GCLK16_0)
GPIO_31_P: U3.H12(IO_L35P_GCLK17_0)
GPIO_32_N: U3.G13(IO_L38N_VREF_0)
GPIO_32_P: U3.H13(IO_L38P_0)
GPIO_33_N: U3.G15(IO_L49N_0)
GPIO_33_P: U3.H14(IO_L49P_0)
HSWAP: U3.C3(IO_L1P_HSWAPEN_0) ; port HSWAP
INIT_B: U3.Y4(IO_L65P_INIT_B_2) ; port INIT_B
LED0: U3.AB11(IO_L32N_GCLK28_2)
LED1: U3.AB16(IO_L19N_2)
LED2: U3.AA10(IO_L41P_2)
M0: R33.1 U3.AA21(IO_L1N_M0_CMPMISO_2)
M1: R34.1 U3.Y19(IO_L13P_M1_2)
PERST: U3.AB15(IO_L21N_2) ; port PERST
SD_CLK: U3.Y5(IO_L62P_D5_2) ; port SD_CLK
SD_CMD: U3.AB5(IO_L62N_D6_2) ; port SD_CMD
SD_DATA0: U3.U6(IO_L64N_D9_2)
SD_DATA1: U3.T7(IO_L64P_D8_2)
SD_DATA2: U3.AB4(IO_L63N_2)
SD_DATA3: U3.AA4(IO_L63P_2)
SMB_CLK: U3.AB17(IO_L15N_2) ; port SMB_CLK
SMB_DATA: U3.AB18(IO_L14N_D12_2) ; port SMB_DATA
SPI_CLK: U3.Y20(IO_L1P_CCLK_2) U4.6(CLK)
SPI_CS_N: R27.1 U3.AA3(IO_L65N_CSO_B_2) U4.1(#CS)
SPI_D1_MISO2: R32.1 U3.R13(IO_L12P_D1_MISO2_2) ; port SPI_D1_MISO2
SPI_D2_MISO3: R30.1 U3.T14(IO_L12N_D2_MISO3_2) U4.7(HLD#/RST#(IO3))
SPI_DO_DIN_MISO1: R31.1 U3.AA20(IO_L3P_D0_DIN_MISO_MISO1_2)
SPI_MOSI_CSI_N_MISO0: U3.AB20(IO_L3N_MOSI_CSI_B_MISO0_2) U4.5(DI(IO0))
NetC24_2: C24.2 R46.1 R48.1 U5.3(OUTPUT)
NetC97_1: C97.1 P3.1(SIG)
NetR28_1: R28.1 R31.2 U4.2(DO(IO1))
NetR29_2: R29.2 R32.2 U4.3(WP#(IO2))
NetR35_2: R35.2 U5.1(STANDBY)
NetR36_2: R36.2 U6.1(STANDBY)

Not connected (* = marked no-connect by the designer): U3 AA6(IO_L49P_D3_2)* AA8(IO_L45P_2)* AA12(IO_L31P_GCLK31_D14_2)* AA14(IO_L6P_2)* AA16(IO_L19P_2)* AA18(IO_L14P_D11_2)* AB6(IO_L49N_D4_2)* AB7(IO_L47N_2)* AB8(IO_L45N_2)* AB9(IO_L43N_2)* AB10(IO_L41N_VREF_2)* AB12(IO_L31N_GCLK30_D15_2)* AB19(IO_L13N_D10_2) D3(IO_L1N_VREF_0)* R8(IO_L59N_2)* R9(IO_L59P_2)* R11(IO_L22P_2)* T8(IO_L57P_2)* T10(IO_L46P_2)* T11(IO_L22N_2)* T12(IO_L29P_GCLK3_2)* T15(IO_L23P_2)* U8(IO_L57N_2)* U9(IO_L50P_2)* U10(IO_L46N_2)* U12(IO_L29N_GCLK2_2)* U13(IO_L16N_VREF_2)* U14(IO_L16P_2)* U15(IO_L23N_2)* U16(IO_L4P_2)* V7(IO_L58P_2)* V9(IO_L50N_2)* V11(IO_L42P_2)* V13(IO_L18P_2)* V15(IO_L4N_VREF_2)* V17(IO_L2P_CMPCLK_2)* W6(IO_L60P_2)* W8(IO_L58N_2)* W9(IO_L48P_D7_2)* W10(IO_L44P_2)* W11(IO_L42N_2)* W12(IO_L40P_2)* W13(IO_L18N_2)* W14(IO_L20P_2)* W15(IO_L17N_2)* W17(IO_L5P_2)* W18(IO_L2N_CMPMOSI_2)* Y6(IO_L60N_2)* Y7(IO_L47P_2)* Y8(IO_L48N_RDWR_B_VREF_2)* Y9(IO_L43P_2)* Y10(IO_L44N_2)* Y11(IO_L32P_GCLK29_2)* Y12(IO_L40N_2)* Y14(IO_L20N_2)* Y15(IO_L21P_2)* Y16(IO_L17P_2)* Y17(IO_L15P_2)* Y18(IO_L5N_2)*

### Buses and harness runs
bus LED[0..2] = port LED[0..2]
bus SD_DATA[0..3] = port SD_DATA[0..3]

### Layout directives
net class SPI: SPI_CLK, SPI_CS_N, SPI_D1_MISO2, SPI_D2_MISO3, SPI_DO_DIN_MISO1, SPI_MOSI_CSI_N_MISO0
net class SD: SD_CLK, SD_CMD, SD_DATA0, SD_DATA1, SD_DATA2, SD_DATA3

### Notes on the sheet
- (near U5) 100MHz
- (near U6) 32.768KHz
- POLYSOME CRYPTO 01
- (in symbol XC6SLX150T-3FGG484I, part A) BANK 0
- (in symbol XC6SLX150T-3FGG484I, part C) BANK 2

### Library data of the parts
C23-C27 = Cap Semi: Capacitor (Semiconductor SIM Model); Published: 8-Jun-2000; LatestRevisionDate: 29-May-2009; LatestRevisionNote: IPC-7351 Footprint Added.; PackageReference: C1206; Publisher: Altium Limited; PackageDescription: Chip Capacitor
C97 = Cap: Capacitor; Published: 8-Jun-2000; LatestRevisionDate: 17-Jul-2002; LatestRevisionNote: Re-released for DXP Platform.; PackageReference: RAD-0.3; Publisher: Altium Limited; PackageDescription: Radial Cap, Thru-Hole; 2 Leads; 0.3 in Pin Spacing
R27-R36 R46 R48 = Res Semi: Semiconductor Resistor; Published: 8-Jun-2000; LatestRevisionDate: 17-Jul-2002; LatestRevisionNote: Re-released for DXP Platform.; PackageReference: AXIAL-0.5; Publisher: Altium Limited; PackageDescription: Axial Device, Thru-Hole; 2 Leads; 0.5 in Pin Spacing
U3 = XC6SLX150T-3FGG484I: as U3 on sheet FPGA_A; Published: 17-Nov-2009; DatasheetVersion: ver1.6, Nov-2010; PackageVersion: ver1.1, Dec-2008; PackageReference: FGG484; Publisher: Altium Limited; PackageDescription: 484-Ball Fine Pitch Ball Grid Array 1.00 mm Pitch (FGG484) - Pb-Free; Supplier 1: Digi-Key; Supplier Part Number 1: XC6SLX150T-3FGG484I-ND; Code_JEDEC: MS-034-AAJ-1; Code_IPC: BGA100P22X22-484; ComponentLink1Description: Manufacturer Link; ComponentLink1URL: http://www.xilinx.com; ComponentLink2Description: Spartan-6 Datasheet; ComponentLink2URL: http://www.xilinx.com/support/documentation/data_sheets/ds160.pdf; ComponentLink3Description: Spartan-6 Documents; ComponentLink3URL: http://www.xilinx.com/support/documentation/spartan-6.htm; ComponentLink4Description: Xilinx.com Home; ComponentLink4URL: http://www.xilinx.com
U4 = N25Q128A13EF840E: IC FLASH 128MBIT 108MHZ 8VDFN; Manufacturer: Micron Technology Inc; Memory Type: FLASH - NOR; Memory Size: 128M (32Mx4); Interface: SPI Serial; Voltage - Supply: 2.7 V ~ 3.6 V; Supplier 1: Digi-Key; Manufacturer Part Number: N25Q128A13EF840E; RoHS: RoHS Compliant; Category: Integrated Circuits (ICs); Stock 1: 2864; Pricing 1: 1=1.88, 10=1.713, 50=1.6588, 100=1.4828, 250=1.4784, 500=1.4564, 1000=1.39392, 2500=1.34288, 5000=1.298 (USD); Packaging: Tray; Format - Memory: FLASH; Speed: 108MHz; Operating Temperature: -40°C ~ 85°C; Package / Case: 8-VDFN Exposed Pad; Supplier Device Package: 8-VDFPN (MLP8) (8x6); ComponentLink1URL: http://www.micron.com/~/media/Documents/Products/Data%20Sheet/NOR%20Flash/Serial%20NOR/N25Q/n25q_128mb_3v_65nm.pdf; ComponentLink1Description: http://www.micron.com/~/media/Documents/Products/Data%20Sheet/NOR%20Flash/Serial%20NOR/N25Q/n25q_128mb_3v_65nm.pdf; Supplier Part Number 1: 557-1561-ND
U5 = ASEM1-100.000MHZ-LC-T: ABRACON - ASEM1-100.000MHZ-LC-T - MEMS OSC, 100MHZ, 3.2 X 2.5MM, CMOS; Product Range: ABRACON - ASEM Series; Frequency Nom: 100; Frequency Stability + / -: 50; Supply Voltage Nom: 3.3; Oscillator Case: SMD, 3.2mm x 2.5; Supplier 1: Newark; Manufacturer: ABRACON; Manufacturer Part Number: ASEM1-100.000MHZ-LC-T; RoHS: YES; Stock 1: 67; Pricing 1: 1=1.63, 10=1.56, 50=1.53, 100=1.31, 500=1.27 (USD); Oscillator Output Compatibility: CMOS; ComponentLink1URL: http://www.abracon.com/Oscillators/ASEM.pdf; ComponentLink1Description: http://www.abracon.com/Oscillators/ASEM.pdf; Supplier Part Number 1: 14N7956
U6 = ASEM1-HZ-LC-T: ABRACON - ASEM1-HZ-LC-T - MEMS OSC, 3.2 X 2.5MM, CMOS; Manufacturer Part Number: ASEM1-xxxxMHZ-LC-T; Product Range: ABRACON - ASEM Series; Frequency Nom: 100; Frequency Stability + / -: 50; Supply Voltage Nom: 3.3; Oscillator Case: SMD, 3.2mm x 2.5; Supplier 1: Newark; Manufacturer: ABRACON; RoHS: YES; Stock 1: 67; Pricing 1: 1=1.63, 10=1.56, 50=1.53, 100=1.31, 500=1.27 (USD); Oscillator Output Compatibility: CMOS; ComponentLink1URL: http://www.abracon.com/Oscillators/ASEM.pdf; ComponentLink1Description: http://www.abracon.com/Oscillators/ASEM.pdf; Supplier Part Number 1: 14N7956

## Sheet FPGA_C.SchDoc: POLYSOME CRYPTO 01
size A3; Revision: V1; SheetNumber: 4; SheetTotal: 8; ProjectName: POLYSOME CRYPTO 01
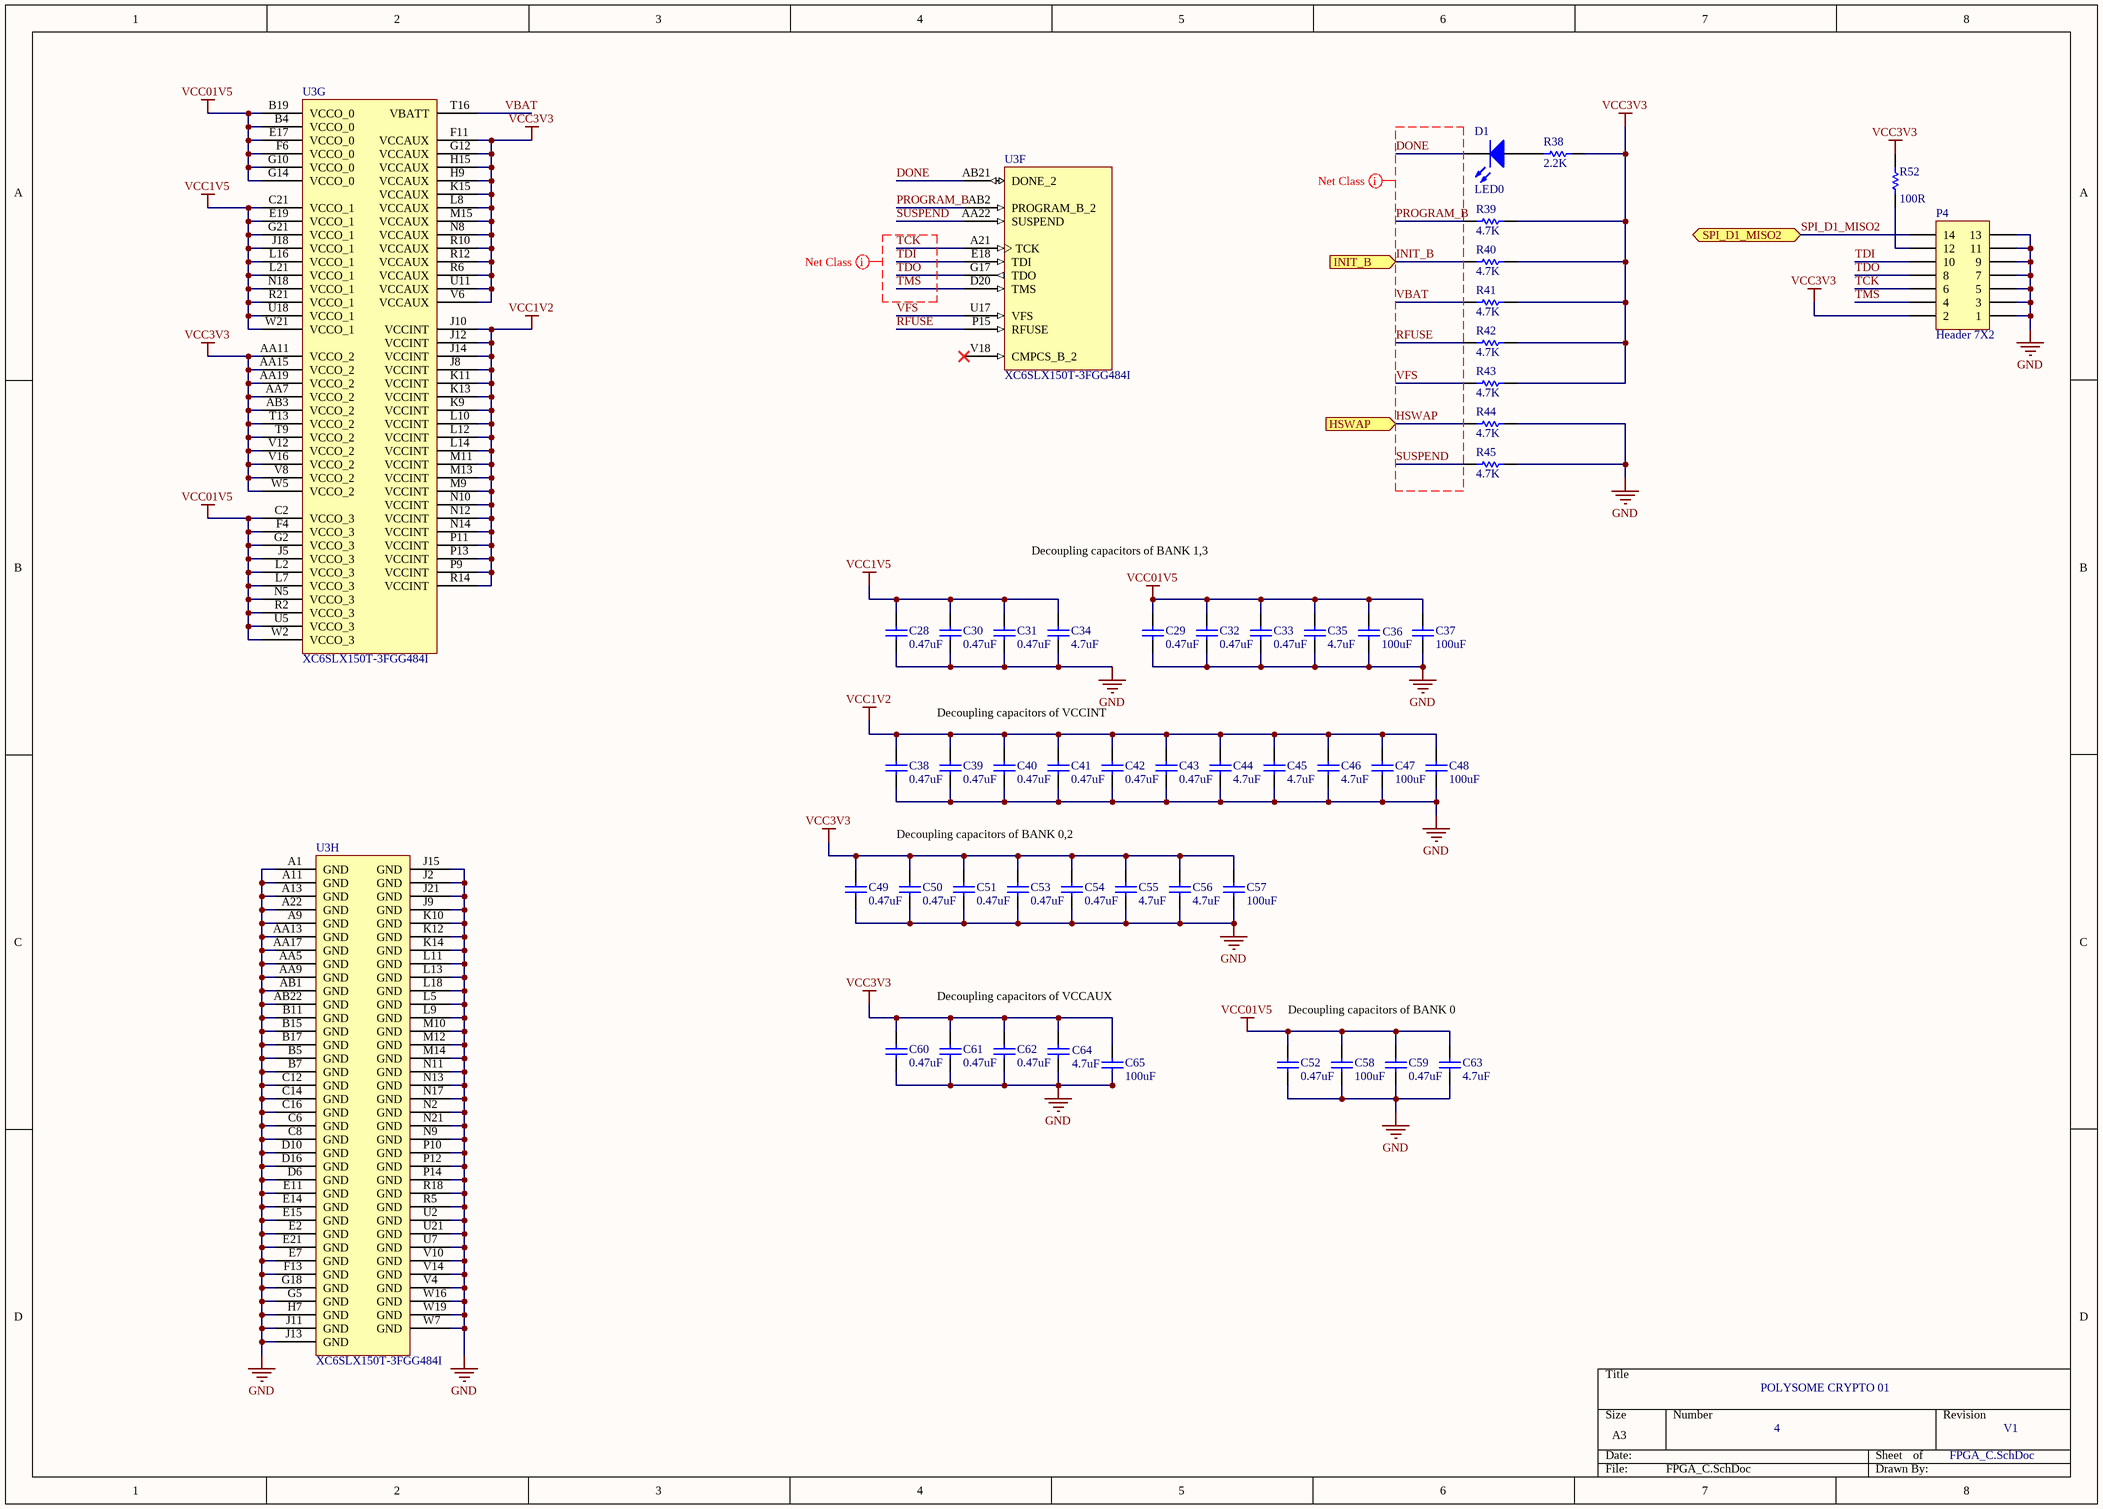
[diagram p4: FPGA_C.SchDoc]

### Parts
C28  value 0.47uF  [0402]  (hidden comment: Cap Semi)
C29  value 0.47uF  [0402]  (hidden comment: Cap Semi)
C30  value 0.47uF  [0402]  (hidden comment: Cap Semi)
C31  value 0.47uF  [0402]  (hidden comment: Cap Semi)
C32  value 0.47uF  [0402]  (hidden comment: Cap Semi)
C33  value 0.47uF  [0402]  (hidden comment: Cap Semi)
C34  value 4.7uF  [1608[0603]]  (hidden comment: Cap Semi)
C35  value 4.7uF  [1608[0603]]  (hidden comment: Cap Semi)
C36  value 100uF  [0402]  (hidden comment: Cap Semi)
C37  value 100uF  [0402]  (hidden comment: Cap Semi)
C38  value 0.47uF  [0402]  (hidden comment: Cap Semi)
C39  value 0.47uF  [0402]  (hidden comment: Cap Semi)
C40  value 0.47uF  [0402]  (hidden comment: Cap Semi)
C41  value 0.47uF  [0402]  (hidden comment: Cap Semi)
C42  value 0.47uF  [0402]  (hidden comment: Cap Semi)
C43  value 0.47uF  [0402]  (hidden comment: Cap Semi)
C44  value 4.7uF  [1608[0603]]  (hidden comment: Cap Semi)
C45  value 4.7uF  [1608[0603]]  (hidden comment: Cap Semi)
C46  value 4.7uF  [1608[0603]]  (hidden comment: Cap Semi)
C47  value 100uF  [0402]  (hidden comment: Cap Semi)
C48  value 100uF  [0402]  (hidden comment: Cap Semi)
C49  value 0.47uF  [0402]  (hidden comment: Cap Semi)
C50  value 0.47uF  [0402]  (hidden comment: Cap Semi)
C51  value 0.47uF  [0402]  (hidden comment: Cap Semi)
C52  value 0.47uF  [0402]  (hidden comment: Cap Semi)
C53  value 0.47uF  [0402]  (hidden comment: Cap Semi)
C54  value 0.47uF  [0402]  (hidden comment: Cap Semi)
C55  value 4.7uF  [1608[0603]]  (hidden comment: Cap Semi)
C56  value 4.7uF  [1608[0603]]  (hidden comment: Cap Semi)
C57  value 100uF  [0402]  (hidden comment: Cap Semi)
C58  value 100uF  [0402]  (hidden comment: Cap Semi)
C59  value 0.47uF  [0402]  (hidden comment: Cap Semi)
C60  value 0.47uF  [0402]  (hidden comment: Cap Semi)
C61  value 0.47uF  [0402]  (hidden comment: Cap Semi)
C62  value 0.47uF  [0402]  (hidden comment: Cap Semi)
C63  value 4.7uF  [1608[0603]]  (hidden comment: Cap Semi)
C64  value 4.7uF  [1608[0603]]  (hidden comment: Cap Semi)
C65  value 100uF  [C1206]  (hidden comment: Cap Semi)
D1  LED0  [1608[0603]]
P4  Header 7X2  [JTAG_WM9059CT-ND]
R38  value 2.2K  [0402]  (hidden comment: Res Semi)
R39  value 4.7K  [0402]  (hidden comment: Res Semi)
R40  value 4.7K  [0402]  (hidden comment: Res Semi)
R41  value 4.7K  [0402]  (hidden comment: Res Semi)
R42  value 4.7K  [0402]  (hidden comment: Res Semi)
R43  value 4.7K  [0402]  (hidden comment: Res Semi)
R44  value 4.7K  [0402]  (hidden comment: Res Semi)
R45  value 4.7K  [0402]  (hidden comment: Res Semi)
R52  value 100R  [0402]  (hidden comment: Res Semi)
U3  XC6SLX150T-3FGG484I  [FGG484]  (parts F,G,H of 8)

### Ports
HSWAP (in), INIT_B (in), SPI_D1_MISO2

### Nets
GND: C28.1 C29.1 C30.1 C31.1 C32.1 C33.1 C34.1 C35.1 C36.1 C37.1 C38.1 C39.1 C40.1 C41.1 C42.1 C43.1 C44.1 C45.1 C46.1 C47.1 C48.1 C49.1 C50.1 C51.1 C52.1 C53.1 C54.1 C55.1 C56.1 C57.1 C58.1 C59.1 C60.1 C61.1 C62.1 C63.1 C64.1 C65.1 P4.1 P4.3 P4.5 P4.7 P4.9 P4.11 P4.13 R44.1 R45.1 U3.A1(GND) U3.A9(GND) U3.A11(GND) U3.A13(GND) U3.A22(GND) U3.AA5(GND) U3.AA9(GND) U3.AA13(GND) U3.AA17(GND) U3.AB1(GND) U3.AB22(GND) U3.B5(GND) U3.B7(GND) U3.B11(GND) U3.B15(GND) U3.B17(GND) U3.C6(GND) U3.C8(GND) U3.C12(GND) U3.C14(GND) U3.C16(GND) U3.D6(GND) U3.D10(GND) U3.D16(GND) U3.E2(GND) U3.E7(GND) U3.E11(GND) U3.E14(GND) U3.E15(GND) U3.E21(GND) U3.F13(GND) U3.G5(GND) U3.G18(GND) U3.H7(GND) U3.J2(GND) U3.J9(GND) U3.J11(GND) U3.J13(GND) U3.J15(GND) U3.J21(GND) U3.K10(GND) U3.K12(GND) U3.K14(GND) U3.L5(GND) U3.L9(GND) U3.L11(GND) U3.L13(GND) U3.L18(GND) U3.M10(GND) U3.M12(GND) U3.M14(GND) U3.N2(GND) U3.N9(GND) U3.N11(GND) U3.N13(GND) U3.N17(GND) U3.N21(GND) U3.P10(GND) U3.P12(GND) U3.P14(GND) U3.R5(GND) U3.R18(GND) U3.U2(GND) U3.U7(GND) U3.U21(GND) U3.V4(GND) U3.V10(GND) U3.V14(GND) U3.W7(GND) U3.W16(GND) U3.W19(GND)
VCC1V2: C38.2 C39.2 C40.2 C41.2 C42.2 C43.2 C44.2 C45.2 C46.2 C47.2 C48.2 U3.J8(VCCINT) U3.J10(VCCINT) U3.J12(VCCINT) U3.J14(VCCINT) U3.K9(VCCINT) U3.K11(VCCINT) U3.K13(VCCINT) U3.L10(VCCINT) U3.L12(VCCINT) U3.L14(VCCINT) U3.M9(VCCINT) U3.M11(VCCINT) U3.M13(VCCINT) U3.N10(VCCINT) U3.N12(VCCINT) U3.N14(VCCINT) U3.P9(VCCINT) U3.P11(VCCINT) U3.P13(VCCINT) U3.R14(VCCINT)
VCC01V5: C29.2 C32.2 C33.2 C35.2 C36.2 C37.2 C52.2 C58.2 C59.2 C63.2 U3.B4(VCCO_0) U3.B19(VCCO_0) U3.C2(VCCO_3) U3.E17(VCCO_0) U3.F4(VCCO_3) U3.F6(VCCO_0) U3.G2(VCCO_3) U3.G10(VCCO_0) U3.G14(VCCO_0) U3.J5(VCCO_3) U3.L2(VCCO_3) U3.L7(VCCO_3) U3.N5(VCCO_3) U3.R2(VCCO_3) U3.U5(VCCO_3) U3.W2(VCCO_3)
VCC1V5: C28.2 C30.2 C31.2 C34.2 U3.C21(VCCO_1) U3.E19(VCCO_1) U3.G21(VCCO_1) U3.J18(VCCO_1) U3.L16(VCCO_1) U3.L21(VCCO_1) U3.N18(VCCO_1) U3.R21(VCCO_1) U3.U18(VCCO_1) U3.W21(VCCO_1)
VCC3V3: C49.2 C50.2 C51.2 C53.2 C54.2 C55.2 C56.2 C57.2 C60.2 C61.2 C62.2 C64.2 C65.2 P4.2 R38.1 R39.1 R40.1 R41.1 R42.1 R43.1 R52.2 U3.AA7(VCCO_2) U3.AA11(VCCO_2) U3.AA15(VCCO_2) U3.AA19(VCCO_2) U3.AB3(VCCO_2) U3.F11(VCCAUX) U3.G12(VCCAUX) U3.H9(VCCAUX) U3.H15(VCCAUX) U3.K15(VCCAUX) U3.L8(VCCAUX) U3.M15(VCCAUX) U3.N8(VCCAUX) U3.R6(VCCAUX) U3.R10(VCCAUX) U3.R12(VCCAUX) U3.T9(VCCO_2) U3.T13(VCCO_2) U3.U11(VCCAUX) U3.V6(VCCAUX) U3.V8(VCCO_2) U3.V12(VCCO_2) U3.V16(VCCO_2) U3.W5(VCCO_2)
DONE: D1.2(K) U3.AB21(DONE_2)
HSWAP: R44.2 ; port HSWAP
INIT_B: R40.2 ; port INIT_B
PROGRAM_B: R39.2 U3.AB2(PROGRAM_B_2)
RFUSE: R42.2 U3.P15(RFUSE)
SPI_D1_MISO2: P4.14 ; port SPI_D1_MISO2
SUSPEND: R45.2 U3.AA22(SUSPEND)
TCK: P4.6 U3.A21(TCK)
TDI: P4.10 U3.E18(TDI)
TDO: P4.8 U3.G17(TDO)
TMS: P4.4 U3.D20(TMS)
VBAT: R41.2 U3.T16(VBATT)
VFS: R43.2 U3.U17(VFS)
NetD1_1: D1.1(A) R38.2
NetP4_12: P4.12 R52.1

Not connected (* = marked no-connect by the designer): U3 V18(CMPCS_B_2)*

### Layout directives
net class JTAG: TCK, TDI, TDO, TMS
net class CONFIG: DONE, HSWAP, INIT_B, PROGRAM_B, RFUSE, SUSPEND, VBAT, VFS

### Notes on the sheet
- Decoupling capacitors of BANK 1,3
- Decoupling capacitors of VCCINT
- Decoupling capacitors of BANK 0,2
- Decoupling capacitors of VCCAUX
- Decoupling capacitors of BANK 0

### Library data of the parts
C28-C65 = Cap Semi: Capacitor (Semiconductor SIM Model); Published: 8-Jun-2000; LatestRevisionDate: 29-May-2009; LatestRevisionNote: IPC-7351 Footprint Added.; PackageReference: C1206; Publisher: Altium Limited; PackageDescription: Chip Capacitor
D1 = LED0: Typical INFRARED GaAs LED; Published: 8-Jun-2000; LatestRevisionDate: 08-Jul-2005; LatestRevisionNote: Mech Layer 1 removed.; PackageReference: LED-0; Publisher: Altium Limited; PackageDescription: LED; 2 Leads
P4 = Header 7X2: Header, 7-Pin, Dual row; LatestRevisionDate: 17-Jul-2002; LatestRevisionNote: Re-released for DXP Platform.; Publisher: Altium Limited
R38-R45 R52 = Res Semi: Semiconductor Resistor; Published: 8-Jun-2000; LatestRevisionDate: 17-Jul-2002; LatestRevisionNote: Re-released for DXP Platform.; PackageReference: AXIAL-0.5; Publisher: Altium Limited; PackageDescription: Axial Device, Thru-Hole; 2 Leads; 0.5 in Pin Spacing
U3 = XC6SLX150T-3FGG484I: as U3 on sheet FPGA_A; Published: 17-Nov-2009; DatasheetVersion: ver1.6, Nov-2010; PackageVersion: ver1.1, Dec-2008; PackageReference: FGG484; Publisher: Altium Limited; PackageDescription: 484-Ball Fine Pitch Ball Grid Array 1.00 mm Pitch (FGG484) - Pb-Free; Supplier 1: Digi-Key; Supplier Part Number 1: XC6SLX150T-3FGG484I-ND; Code_JEDEC: MS-034-AAJ-1; Code_IPC: BGA100P22X22-484; ComponentLink1Description: Manufacturer Link; ComponentLink1URL: http://www.xilinx.com; ComponentLink2Description: Spartan-6 Datasheet; ComponentLink2URL: http://www.xilinx.com/support/documentation/data_sheets/ds160.pdf; ComponentLink3Description: Spartan-6 Documents; ComponentLink3URL: http://www.xilinx.com/support/documentation/spartan-6.htm; ComponentLink4Description: Xilinx.com Home; ComponentLink4URL: http://www.xilinx.com

## Sheet MiniPCIe.SchDoc: POLYSOME CRYPTO 01
size A4; Revision: V1; SheetNumber: 7; SheetTotal: 8; ProjectName: POLYSOME CRYPTO 01
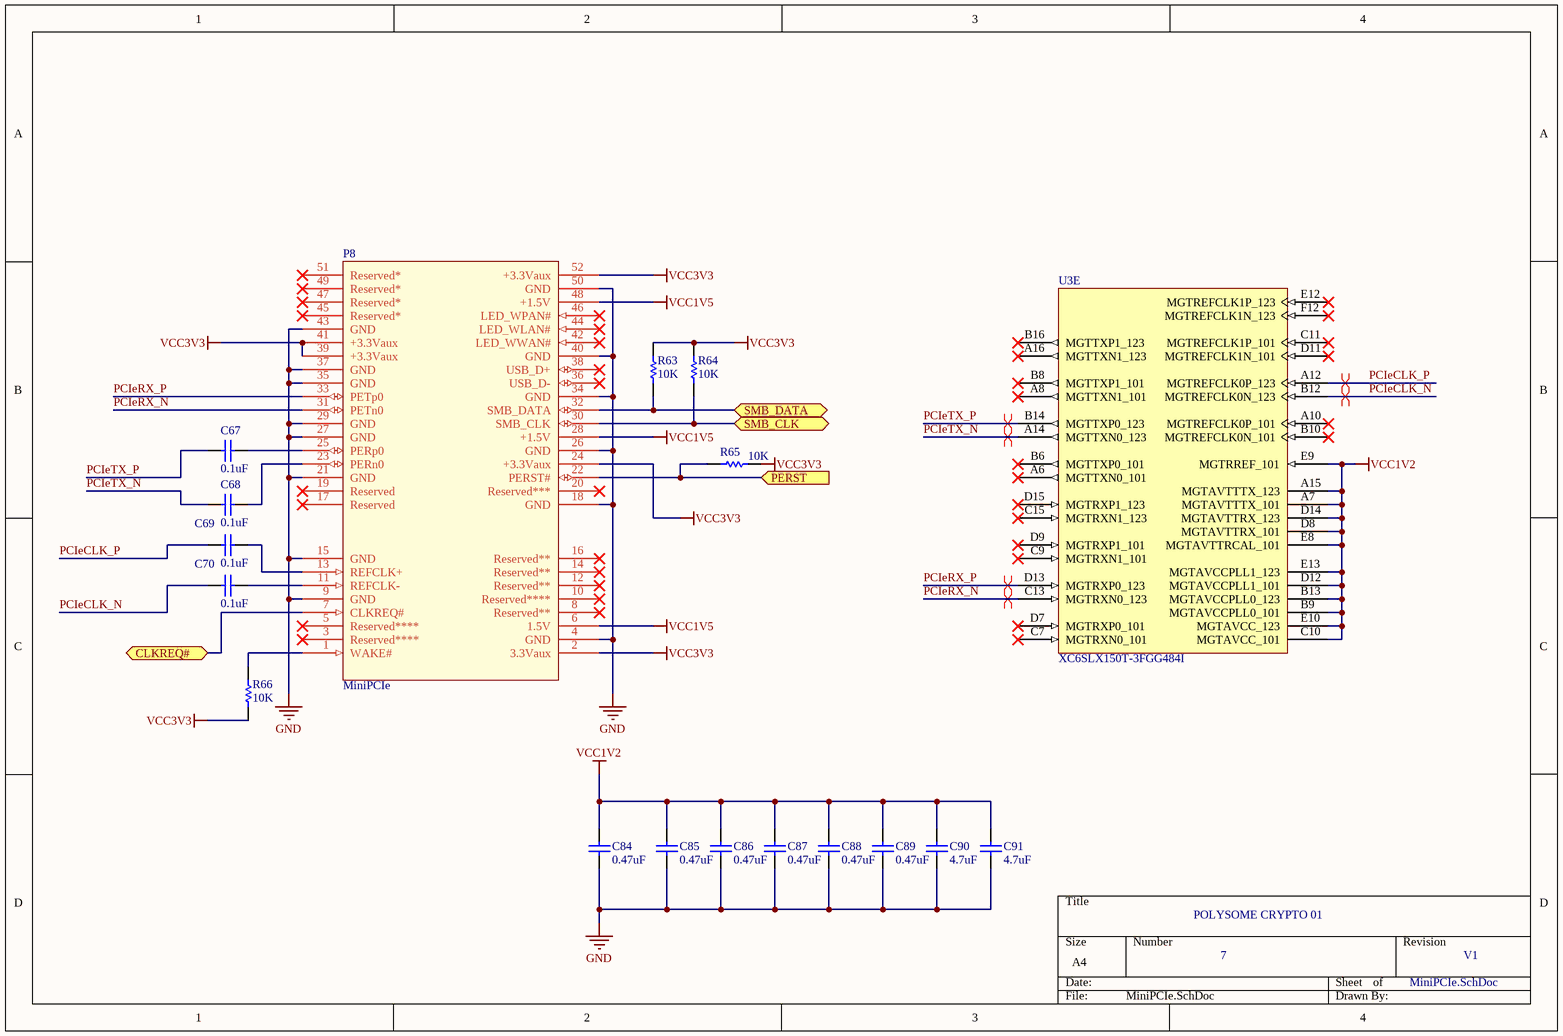
[diagram p5: MiniPCIe.SchDoc]

### Parts
C67  value 0.1uF  [0402]  (hidden comment: Cap Semi)
C68  value 0.1uF  [0402]  (hidden comment: Cap Semi)
C69  value 0.1uF  [0402]  (hidden comment: Cap Semi)
C70  value 0.1uF  [0402]  (hidden comment: Cap Semi)
C84  value 0.47uF  [0402]  (hidden comment: Cap Semi)
C85  value 0.47uF  [0402]  (hidden comment: Cap Semi)
C86  value 0.47uF  [0402]  (hidden comment: Cap Semi)
C87  value 0.47uF  [0402]  (hidden comment: Cap Semi)
C88  value 0.47uF  [0402]  (hidden comment: Cap Semi)
C89  value 0.47uF  [0402]  (hidden comment: Cap Semi)
C90  value 4.7uF  [0402]  (hidden comment: Cap Semi)
C91  value 4.7uF  [0402]  (hidden comment: Cap Semi)
P8  MiniPCIe  [Mini PCI Express]
R63  value 10K  [0402]  (hidden comment: Res Semi)
R64  value 10K  [0402]  (hidden comment: Res Semi)
R65  value 10K  [0402]  (hidden comment: Res Semi)
R66  value 10K  [0402]  (hidden comment: Res Semi)
U3  XC6SLX150T-3FGG484I  [FGG484]  (part E of 8)

### Ports
CLKREQ#, PERST (in), SMB_CLK (bidir), SMB_DATA (bidir)

### Nets
GND: C84.2 C85.2 C86.2 C87.2 C88.2 C89.2 C90.2 C91.2 P8.4(GND) P8.9(GND) P8.15(GND) P8.18(GND) P8.21(GND) P8.26(GND) P8.27(GND) P8.29(GND) P8.34(GND) P8.35(GND) P8.37(GND) P8.40(GND) P8.43(GND) P8.50(GND)
VCC1V2: C84.1 C85.1 C86.1 C87.1 C88.1 C89.1 C90.1 C91.1 U3.A7(MGTAVTTTX_101) U3.A15(MGTAVTTTX_123) U3.B9(MGTAVCCPLL0_101) U3.B13(MGTAVCCPLL0_123) U3.C10(MGTAVCC_101) U3.D8(MGTAVTTRX_101) U3.D12(MGTAVCCPLL1_101) U3.D14(MGTAVTTRX_123) U3.E8(MGTAVTTRCAL_101) U3.E9(MGTRREF_101) U3.E10(MGTAVCC_123) U3.E13(MGTAVCCPLL1_123)
VCC1V5: P8.6(1.5V) P8.28(+1.5V) P8.48(+1.5V)
VCC3V3: P8.2(3.3Vaux) P8.24(+3.3Vaux) P8.39(+3.3Vaux) P8.41(+3.3Vaux) P8.52(+3.3Vaux) R63.2 R64.2 R65.2 R66.1
CLKREQ#: P8.7(CLKREQ#) ; port CLKREQ#
PCIeCLK_N: C70.2 U3.B12(MGTREFCLK0N_123)
PCIeCLK_P: C69.2 U3.A12(MGTREFCLK0P_123)
PCIeRX_N: P8.31(PETn0) U3.C13(MGTRXN0_123)
PCIeRX_P: P8.33(PETp0) U3.D13(MGTRXP0_123)
PCIeTX_N: C68.2 U3.A14(MGTTXN0_123)
PCIeTX_P: C67.2 U3.B14(MGTTXP0_123)
PERST: P8.22(PERST#) R65.1 ; port PERST
SMB_CLK: P8.30(SMB_CLK) R64.1 ; port SMB_CLK
SMB_DATA: P8.32(SMB_DATA) R63.1 ; port SMB_DATA
NetC67_1: C67.1 P8.25(PERp0)
NetC68_1: C68.1 P8.23(PERn0)
NetC69_1: C69.1 P8.13(REFCLK+)
NetC70_1: C70.1 P8.11(REFCLK-)
NetP8_1: P8.1(WAKE#) R66.2

Not connected (* = marked no-connect by the designer): P8 3(Reserved****)* 5(Reserved****)* 8(Reserved**)* 10(Reserved****)* 12(Reserved**)* 14(Reserved**)* 16(Reserved**)* 17(Reserved)* 19(Reserved)* 20(Reserved***)* 36(USB_D-)* 38(USB_D+)* 42(LED_WWAN#)* 44(LED_WLAN#)* 45(Reserved*)* 46(LED_WPAN#)* 47(Reserved*)* 49(Reserved*)* 51(Reserved*)*; U3 A6(MGTTXN0_101)* A8(MGTTXN1_101)* A10(MGTREFCLK0P_101)* A16(MGTTXN1_123)* B6(MGTTXP0_101)* B8(MGTTXP1_101)* B10(MGTREFCLK0N_101)* B16(MGTTXP1_123)* C7(MGTRXN0_101)* C9(MGTRXN1_101)* C11(MGTREFCLK1P_101)* C15(MGTRXN1_123)* D7(MGTRXP0_101)* D9(MGTRXP1_101)* D11(MGTREFCLK1N_101)* D15(MGTRXP1_123)* E12(MGTREFCLK1P_123)* F12(MGTREFCLK1N_123)*

### Layout directives
differential pair; net class PCIE: PCIeCLK_N, PCIeCLK_P, PCIeRX_N, PCIeRX_P, PCIeTX_N, PCIeTX_P

### Library data of the parts
C67-C70 C84-C91 = Cap Semi: Capacitor (Semiconductor SIM Model); Published: 8-Jun-2000; LatestRevisionDate: 29-May-2009; LatestRevisionNote: IPC-7351 Footprint Added.; PackageReference: C1206; Publisher: Altium Limited; PackageDescription: Chip Capacitor
R63-R66 = Res Semi: Semiconductor Resistor; Published: 8-Jun-2000; LatestRevisionDate: 17-Jul-2002; LatestRevisionNote: Re-released for DXP Platform.; PackageReference: AXIAL-0.5; Publisher: Altium Limited; PackageDescription: Axial Device, Thru-Hole; 2 Leads; 0.5 in Pin Spacing
U3 = XC6SLX150T-3FGG484I: as U3 on sheet FPGA_A; Published: 17-Nov-2009; DatasheetVersion: ver1.6, Nov-2010; PackageVersion: ver1.1, Dec-2008; PackageReference: FGG484; Publisher: Altium Limited; PackageDescription: 484-Ball Fine Pitch Ball Grid Array 1.00 mm Pitch (FGG484) - Pb-Free; Supplier 1: Digi-Key; Supplier Part Number 1: XC6SLX150T-3FGG484I-ND; Code_JEDEC: MS-034-AAJ-1; Code_IPC: BGA100P22X22-484; ComponentLink1Description: Manufacturer Link; ComponentLink1URL: http://www.xilinx.com; ComponentLink2Description: Spartan-6 Datasheet; ComponentLink2URL: http://www.xilinx.com/support/documentation/data_sheets/ds160.pdf; ComponentLink3Description: Spartan-6 Documents; ComponentLink3URL: http://www.xilinx.com/support/documentation/spartan-6.htm; ComponentLink4Description: Xilinx.com Home; ComponentLink4URL: http://www.xilinx.com

## Sheet PowerSupply.SchDoc: POLYSOME CRYPTO 01
size A3; Revision: V1; SheetNumber: 8; SheetTotal: 8; ProjectName: POLYSOME CRYPTO 01
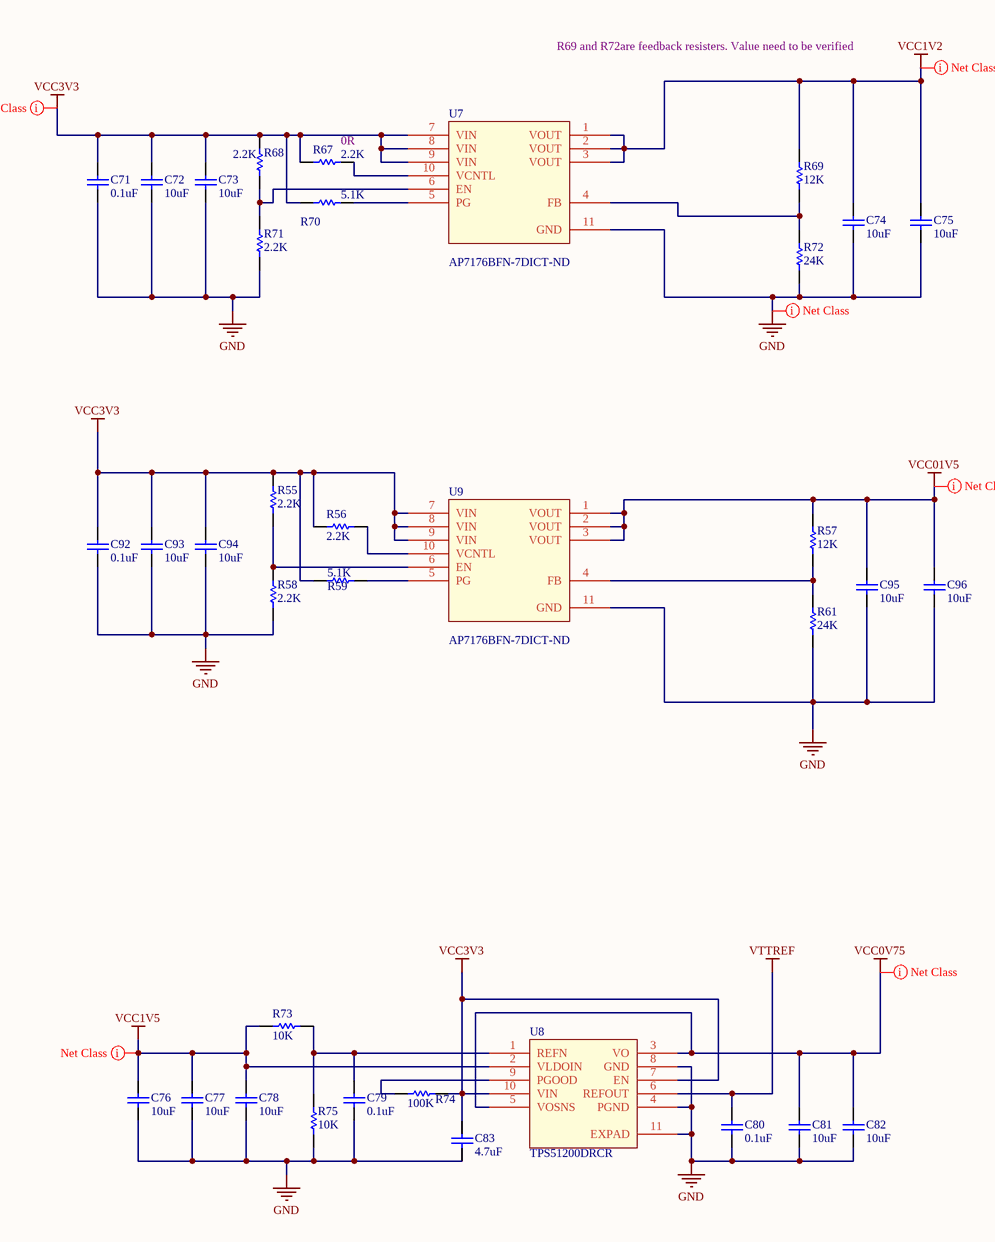
[diagram p6: PowerSupply.SchDoc]

### Parts
C71  value 0.1uF  [0402]  (hidden comment: Cap Semi)
C72  value 10uF  [1608[0603]]  (hidden comment: Cap Semi)
C73  value 10uF  [1608[0603]]  (hidden comment: Cap Semi)
C74  value 10uF  [C0805]  (hidden comment: Cap Semi)
C75  value 10uF  [C0805]  (hidden comment: Cap Semi)
C76  value 10uF  [1608[0603]]  (hidden comment: Cap Semi)
C77  value 10uF  [1608[0603]]  (hidden comment: Cap Semi)
C78  value 10uF  [0402]  (hidden comment: Cap Semi)
C79  value 0.1uF  [0402]  (hidden comment: Cap Semi)
C80  value 0.1uF  [0402]  (hidden comment: Cap Semi)
C81  value 10uF  [0402]  (hidden comment: Cap Semi)
C82  value 10uF  [C0805]  (hidden comment: Cap Semi)
C83  value 4.7uF  [0402]  (hidden comment: Cap Semi)
C92  value 0.1uF  [0402]  (hidden comment: Cap)
C93  value 10uF  [1608[0603]]  (hidden comment: Cap)
C94  value 10uF  [1608[0603]]  (hidden comment: Cap)
C95  value 10uF  [1608[0603]]  (hidden comment: Cap)
C96  value 10uF  [1608[0603]]  (hidden comment: Cap)
R55  value 2.2K  [0402]  (hidden comment: Res Semi)
R56  value 2.2K  [0402]  (hidden comment: Res Semi)
R57  value 12K  [0402]  (hidden comment: Res Semi)
R58  value 2.2K  [0402]  (hidden comment: Res Semi)
R59  value 5.1K  [0402]  (hidden comment: Res Semi)
R61  value 24K  [0402]  (hidden comment: Res Semi)
R67  value 2.2K  [0402]  (hidden comment: Res Semi)
R68  value 2.2K  [0402]  (hidden comment: Res Semi)
R69  value 12K  [0402]  (hidden comment: Res Semi)
R70  value 5.1K  [0402]  (hidden comment: Res Semi)
R71  value 2.2K  [0402]  (hidden comment: Res Semi)
R72  value 24K  [0402]  (hidden comment: Res Semi)
R73  value 10K  [0402]  (hidden comment: Res Semi)
R74  value 100K  [0402]  (hidden comment: Res Semi)
R75  value 10K  [0402]  (hidden comment: Res Semi)
U7  AP7176BFN-7DICT-ND  [PSON50P300X100_HS-11N]
U8  TPS51200DRCR  [PSON50P300X100_HS-11N]
U9  AP7176BFN-7DICT-ND  [PSON50P300X100_HS-11N]

### Nets
GND: C71.2 C72.2 C73.2 C74.2 C75.2 C76.2 C77.2 C78.2 C79.2 C80.2 C81.2 C82.2 C83.2 C92.1 C93.1 C94.1 C95.1 C96.1 R58.1 R61.1 R71.1 R72.1 R75.1 U7.11(GND) U8.4(PGND) U8.8(GND) U8.11(EXPAD) U9.11(GND)
VCC0V75: C81.1 C82.1 U8.3(VO) U8.5(VOSNS)
VCC1V2: C74.1 C75.1 R69.2 U7.1(VOUT) U7.2(VOUT) U7.3(VOUT)
VCC01V5: C95.2 C96.2 R57.2 U9.1(VOUT) U9.2(VOUT) U9.3(VOUT)
VCC1V5: C76.1 C77.1 C78.1 R73.1 U8.2(VLDOIN)
VCC3V3: C71.1 C72.1 C73.1 C83.1 C92.2 C93.2 C94.2 R55.2 R56.2 R59.2 R67.1 R68.2 R70.1 R74.2 U7.7(VIN) U7.8(VIN) U7.9(VIN) U8.7(EN) U8.10(VIN) U9.7(VIN) U9.8(VIN) U9.9(VIN)
VTTREF: C80.1 U8.6(REFOUT)
NetC79_1: C79.1 R73.2 R75.2 U8.1(REFN)
NetR55_1: R55.1 R58.2 U9.6(EN)
NetR56_1: R56.1 U9.10(VCNTL)
NetR57_1: R57.1 R61.2 U9.4(FB)
NetR59_1: R59.1 U9.5(PG)
NetR67_2: R67.2 U7.10(VCNTL)
NetR68_1: R68.1 R71.2 U7.6(EN)
NetR69_1: R69.1 R72.2 U7.4(FB)
NetR70_2: R70.2 U7.5(PG)
NetR74_1: R74.1 U8.9(PGOOD)

### Layout directives
net class VCC1V2: VCC1V2
net class VCC0V75: VCC0V75
net class VCC1V5: VCC1V5
net class VCC3V3: VCC3V3
net class GND: GND
net class VCCO1V5: VCC01V5

### Notes on the sheet
- R69 and R72are feedback resisters. Value need to be verified
- (near R67) 0R

### Library data of the parts
C71-C83 = Cap Semi: Capacitor (Semiconductor SIM Model); Published: 8-Jun-2000; LatestRevisionDate: 29-May-2009; LatestRevisionNote: IPC-7351 Footprint Added.; PackageReference: C1206; Publisher: Altium Limited; PackageDescription: Chip Capacitor
C92-C96 = Cap: Capacitor; Published: 8-Jun-2000; LatestRevisionDate: 17-Jul-2002; LatestRevisionNote: Re-released for DXP Platform.; PackageReference: RAD-0.3; Publisher: Altium Limited; PackageDescription: Radial Cap, Thru-Hole; 2 Leads; 0.3 in Pin Spacing
R55-R59 R61 R67-R75 = Res Semi: Semiconductor Resistor; Published: 8-Jun-2000; LatestRevisionDate: 17-Jul-2002; LatestRevisionNote: Re-released for DXP Platform.; PackageReference: AXIAL-0.5; Publisher: Altium Limited; PackageDescription: Axial Device, Thru-Hole; 2 Leads; 0.5 in Pin Spacing
U7 U9 = AP7176BFN-7: IC REG LDO ADJ 3A 10-DFN; Manufacturer: Diodes Incorporated; Regulator Topology: Positive Adjustable; Voltage - Output: 0.8 V ~ 5.17 V; Voltage - Dropout (Typical): 0.33V @ 3A; Number of Regulators: 1; Voltage - Input: 1.2 V ~ 3.65 V; Current - Limit (Min): 4.5A; Supplier 1: Digi-Key; Manufacturer Part Number: AP7176BFN-7; RoHS: RoHS Compliant; Category: Integrated Circuits (ICs); Stock 1: 8535; Pricing 1: 1=0.99, 10=0.877, 25=0.792, 100=0.693, 250=0.60776, 500=0.539, 1000=0.42625 (USD); Packaging: Cut Tape (CT); Current - Output: 3A; Operating Temperature: -40°C ~ 85°C; Mounting Type: Surface Mount; Package / Case: 10-UFDFN Exposed Pad; Supplier Device Package: 10-UDFN (3x3); ComponentLink1URL: http://diodes.com/datasheets/AP7176B.pdf; ComponentLink1Description: http://diodes.com/datasheets/AP7176B.pdf; Supplier Part Number 1: AP7176BFN-7DICT-ND
U8 = TPS51200DRCR: IC CONV DDR DDR2 DDR3 10SON; Manufacturer: Texas Instruments; Voltage - Input: 2.38 V ~ 3.5 V; Number of Outputs: 1; Supplier 1: Digi-Key; Manufacturer Part Number: TPS51200DRCR; RoHS: RoHS Compliant; Category: Integrated Circuits (ICs); Stock 1: 49935; Pricing 1: 1=2.15, 10=1.944, 25=1.7416, 100=1.566, 250=1.39052, 500=1.215, 750=1.10025, 1000=0.84375 (USD); Packaging: Cut Tape (CT); Applications: Converter, DDR; Voltage - Output: -; Operating Temperature: -40°C ~ 85°C; Mounting Type: Surface Mount; Package / Case: 10-VFDFN Exposed Pad; Supplier Device Package: 10-VSON (3x3); ComponentLink1URL: http://www.ti.com/lit/ds/symlink/tps51200.pdf; ComponentLink1Description: http://www.ti.com/lit/ds/symlink/tps51200.pdf; Supplier Part Number 1: 296-26978-1-ND